# EasyEDA Pro project ProProject_ESP32-CAN (1)_2024-07-23.epro, schematic Schematic1

## Sheets
1 P1: Create Date: 2024-04-11; Page Name: P1; Project Name: ESP32-CAN; Schematic Name: Schematic1; Update Date: 2024-04-11; Company: EasyEDA.com; Drawn: EasyEDA; Page Size: A4; Part Number: JLCPCB-002; Reviewed: EasyEDA; Version: V0.1
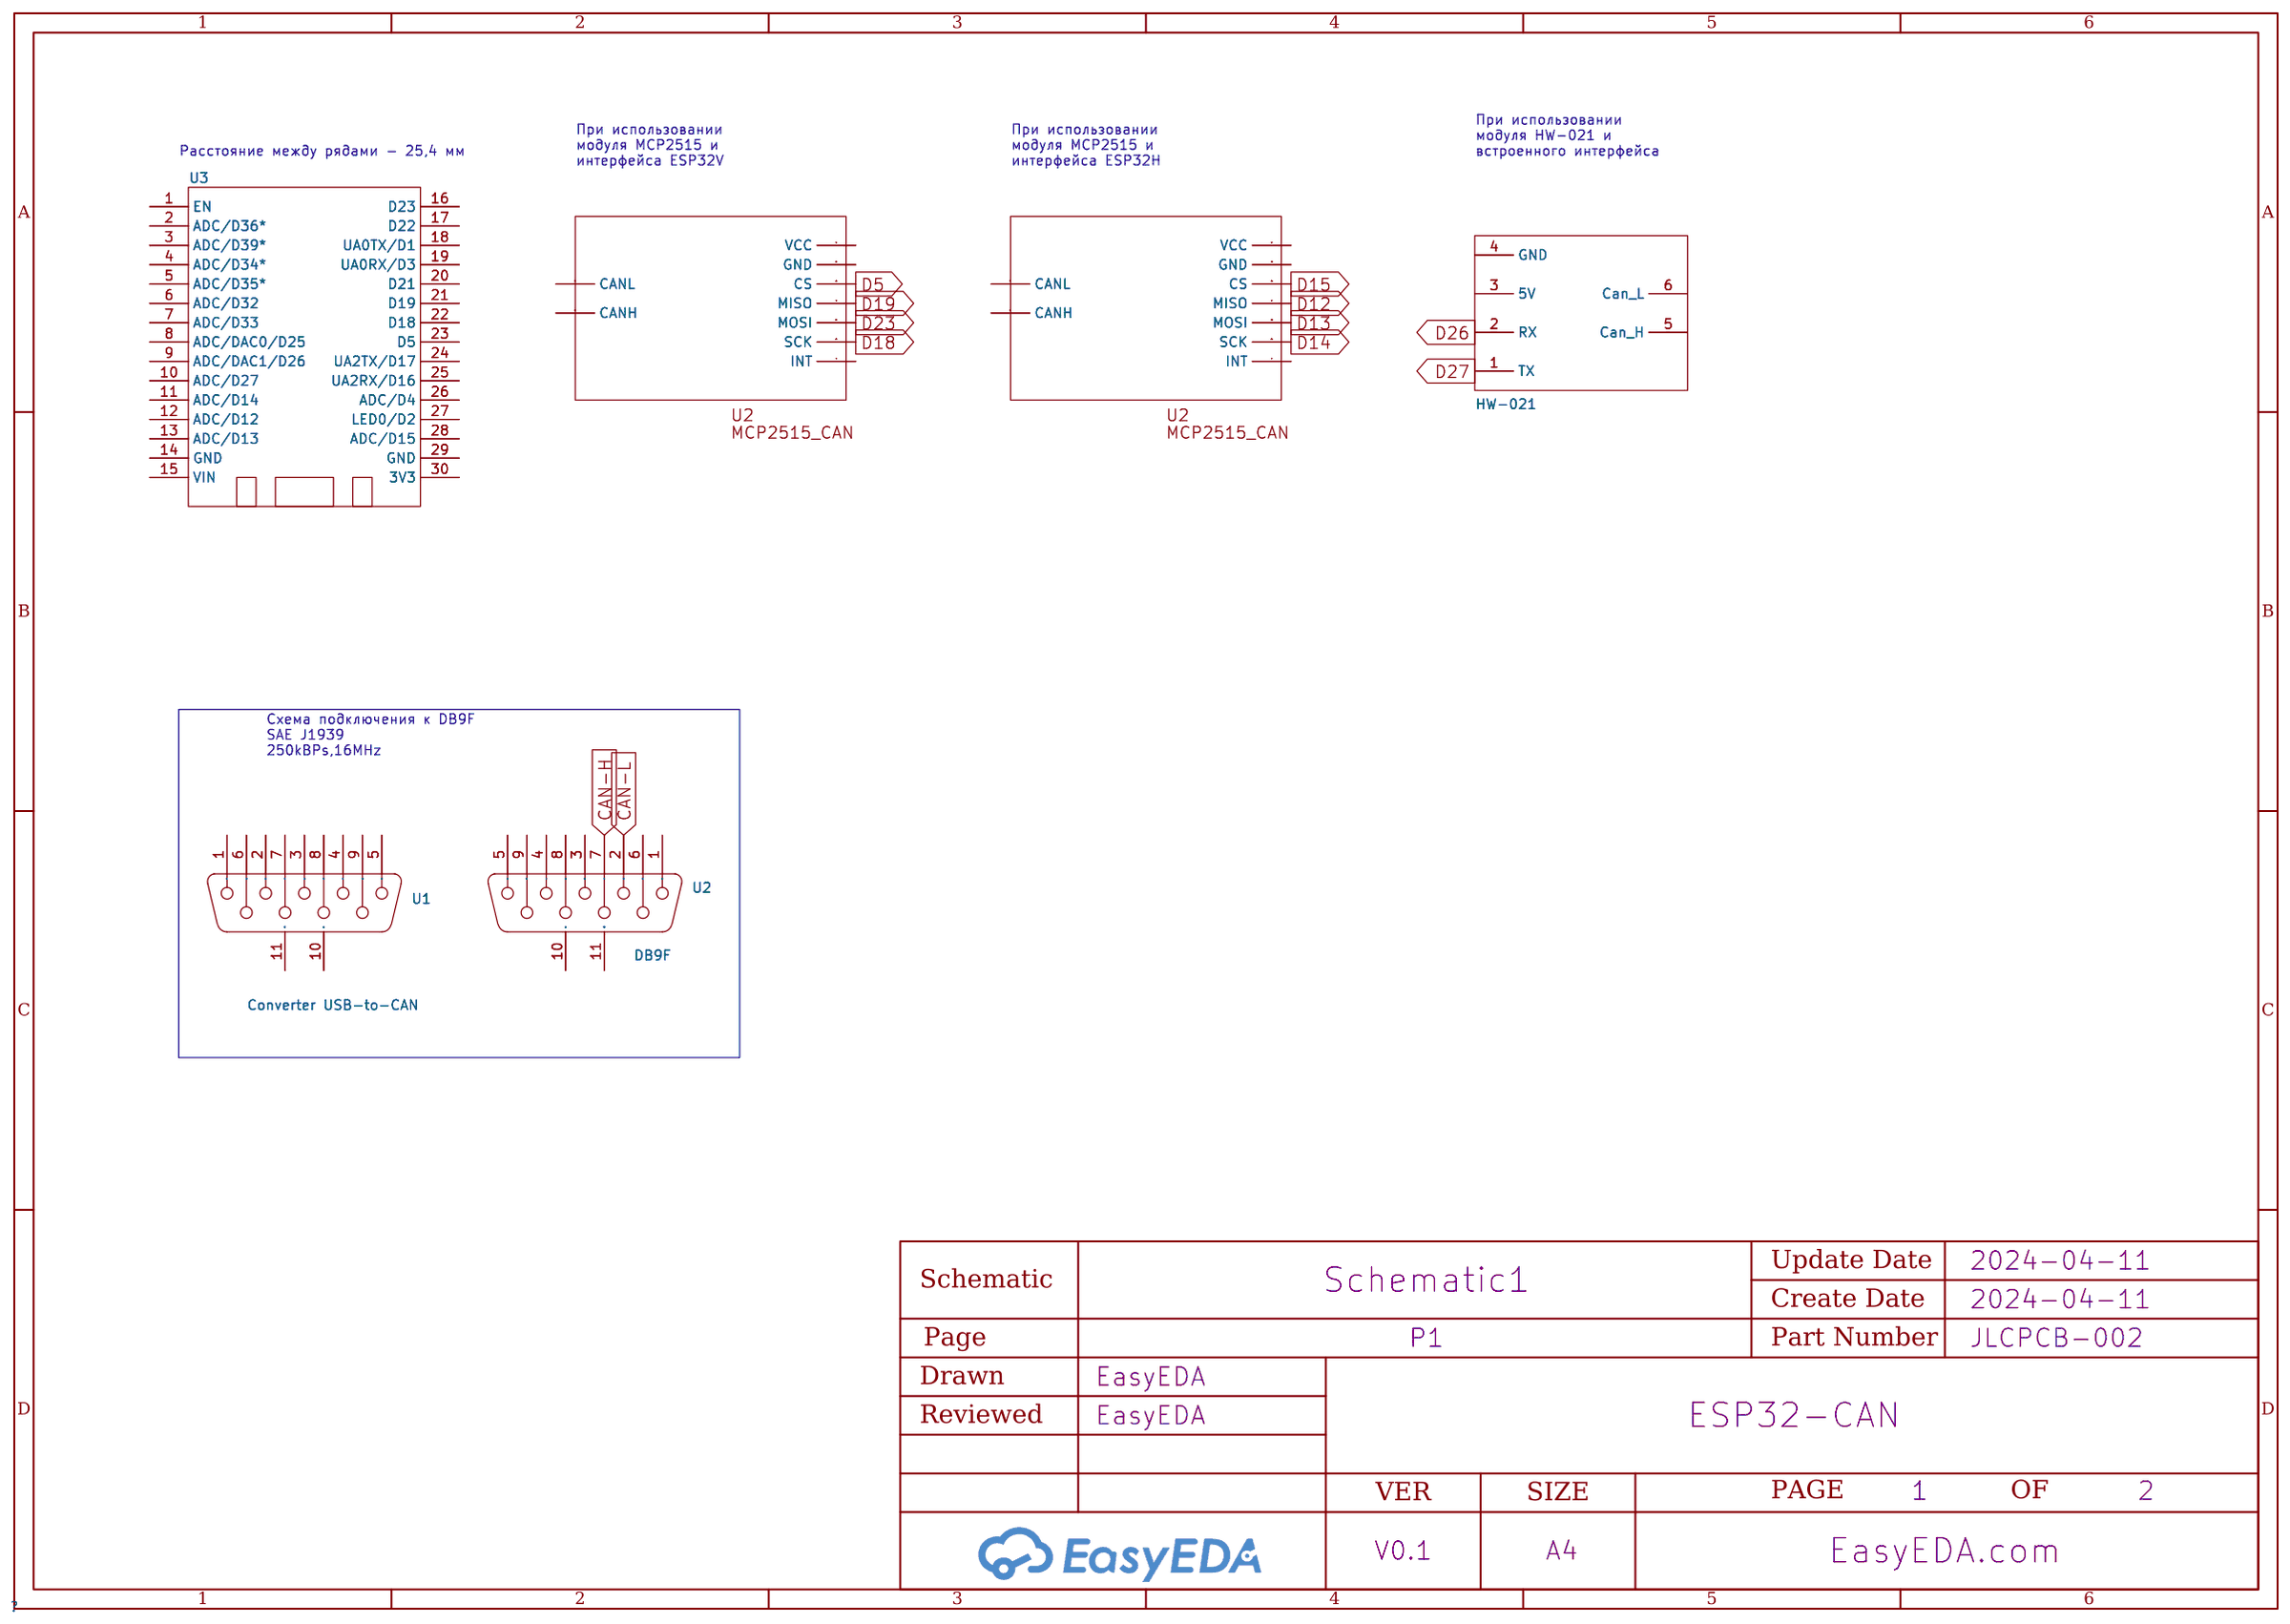
[diagram p5: P1]
2 P2: Create Date: 2024-04-18; Page Name: P2; Update Date: 2024-04-22
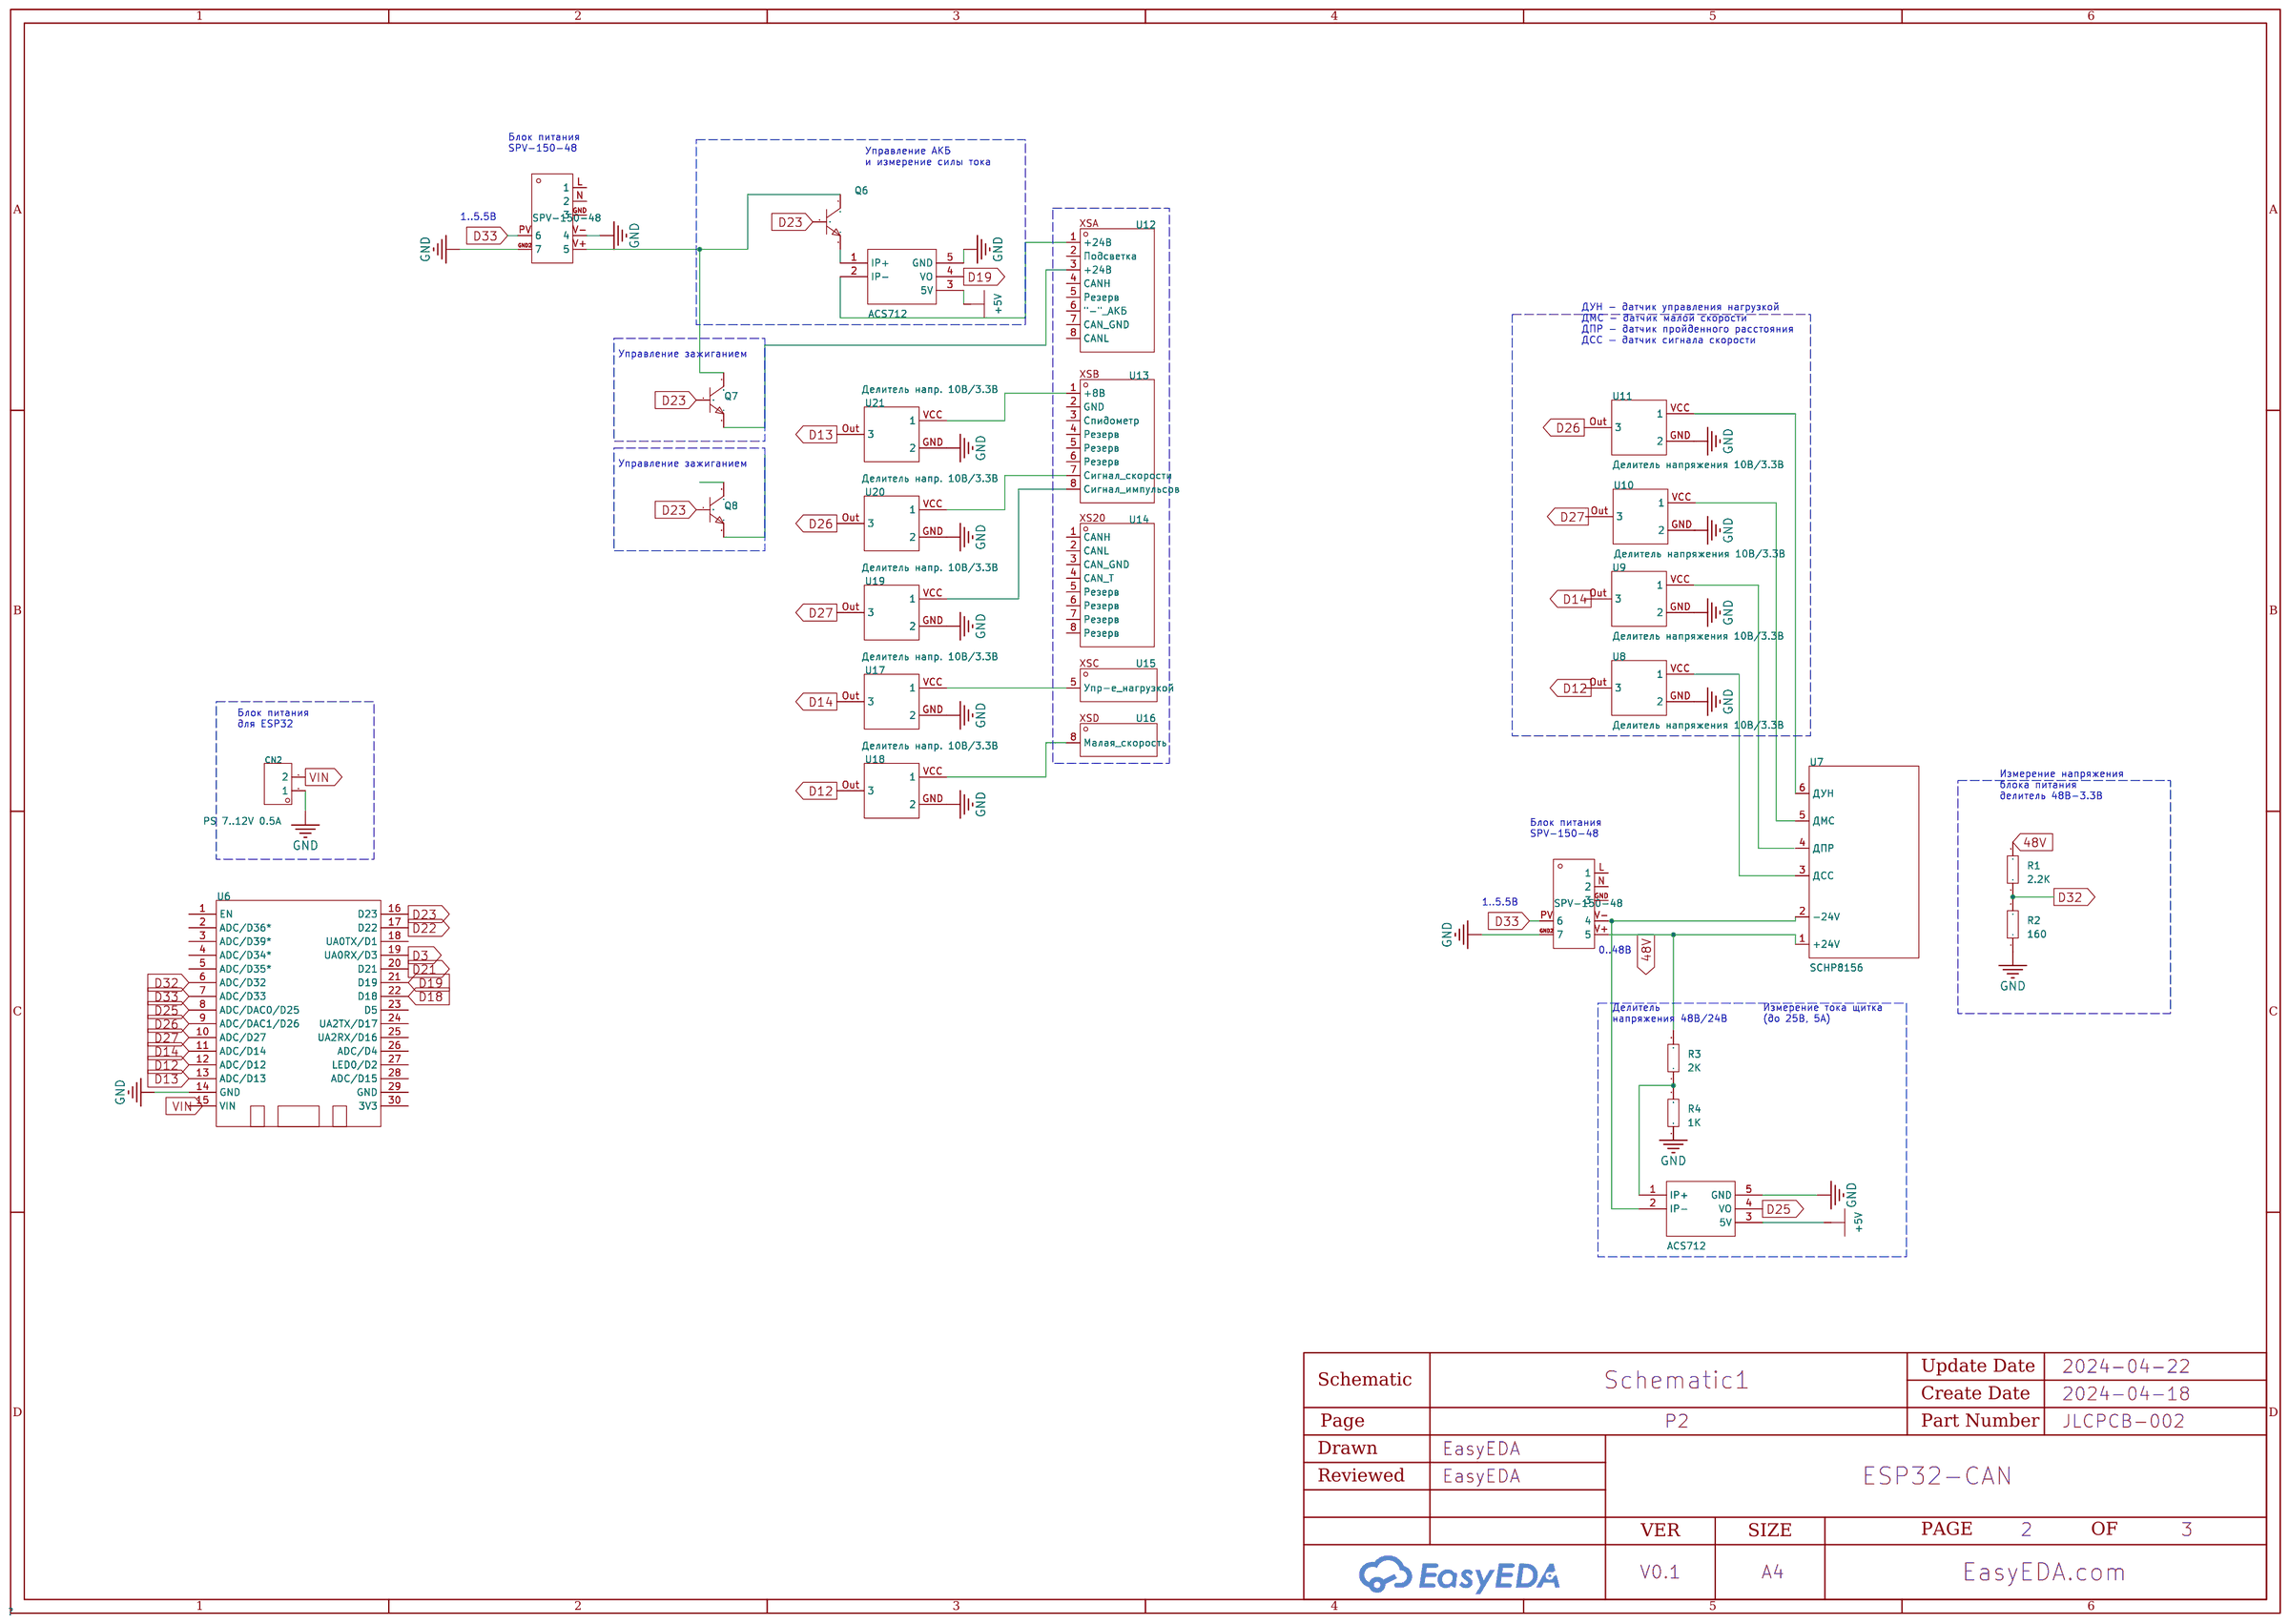
[diagram p6: P2]
3 P2a: Create Date: 2024-04-22; Page Name: P2a; Update Date: 2024-04-22; Page Size: A3; Part Number: JLCPCB-001
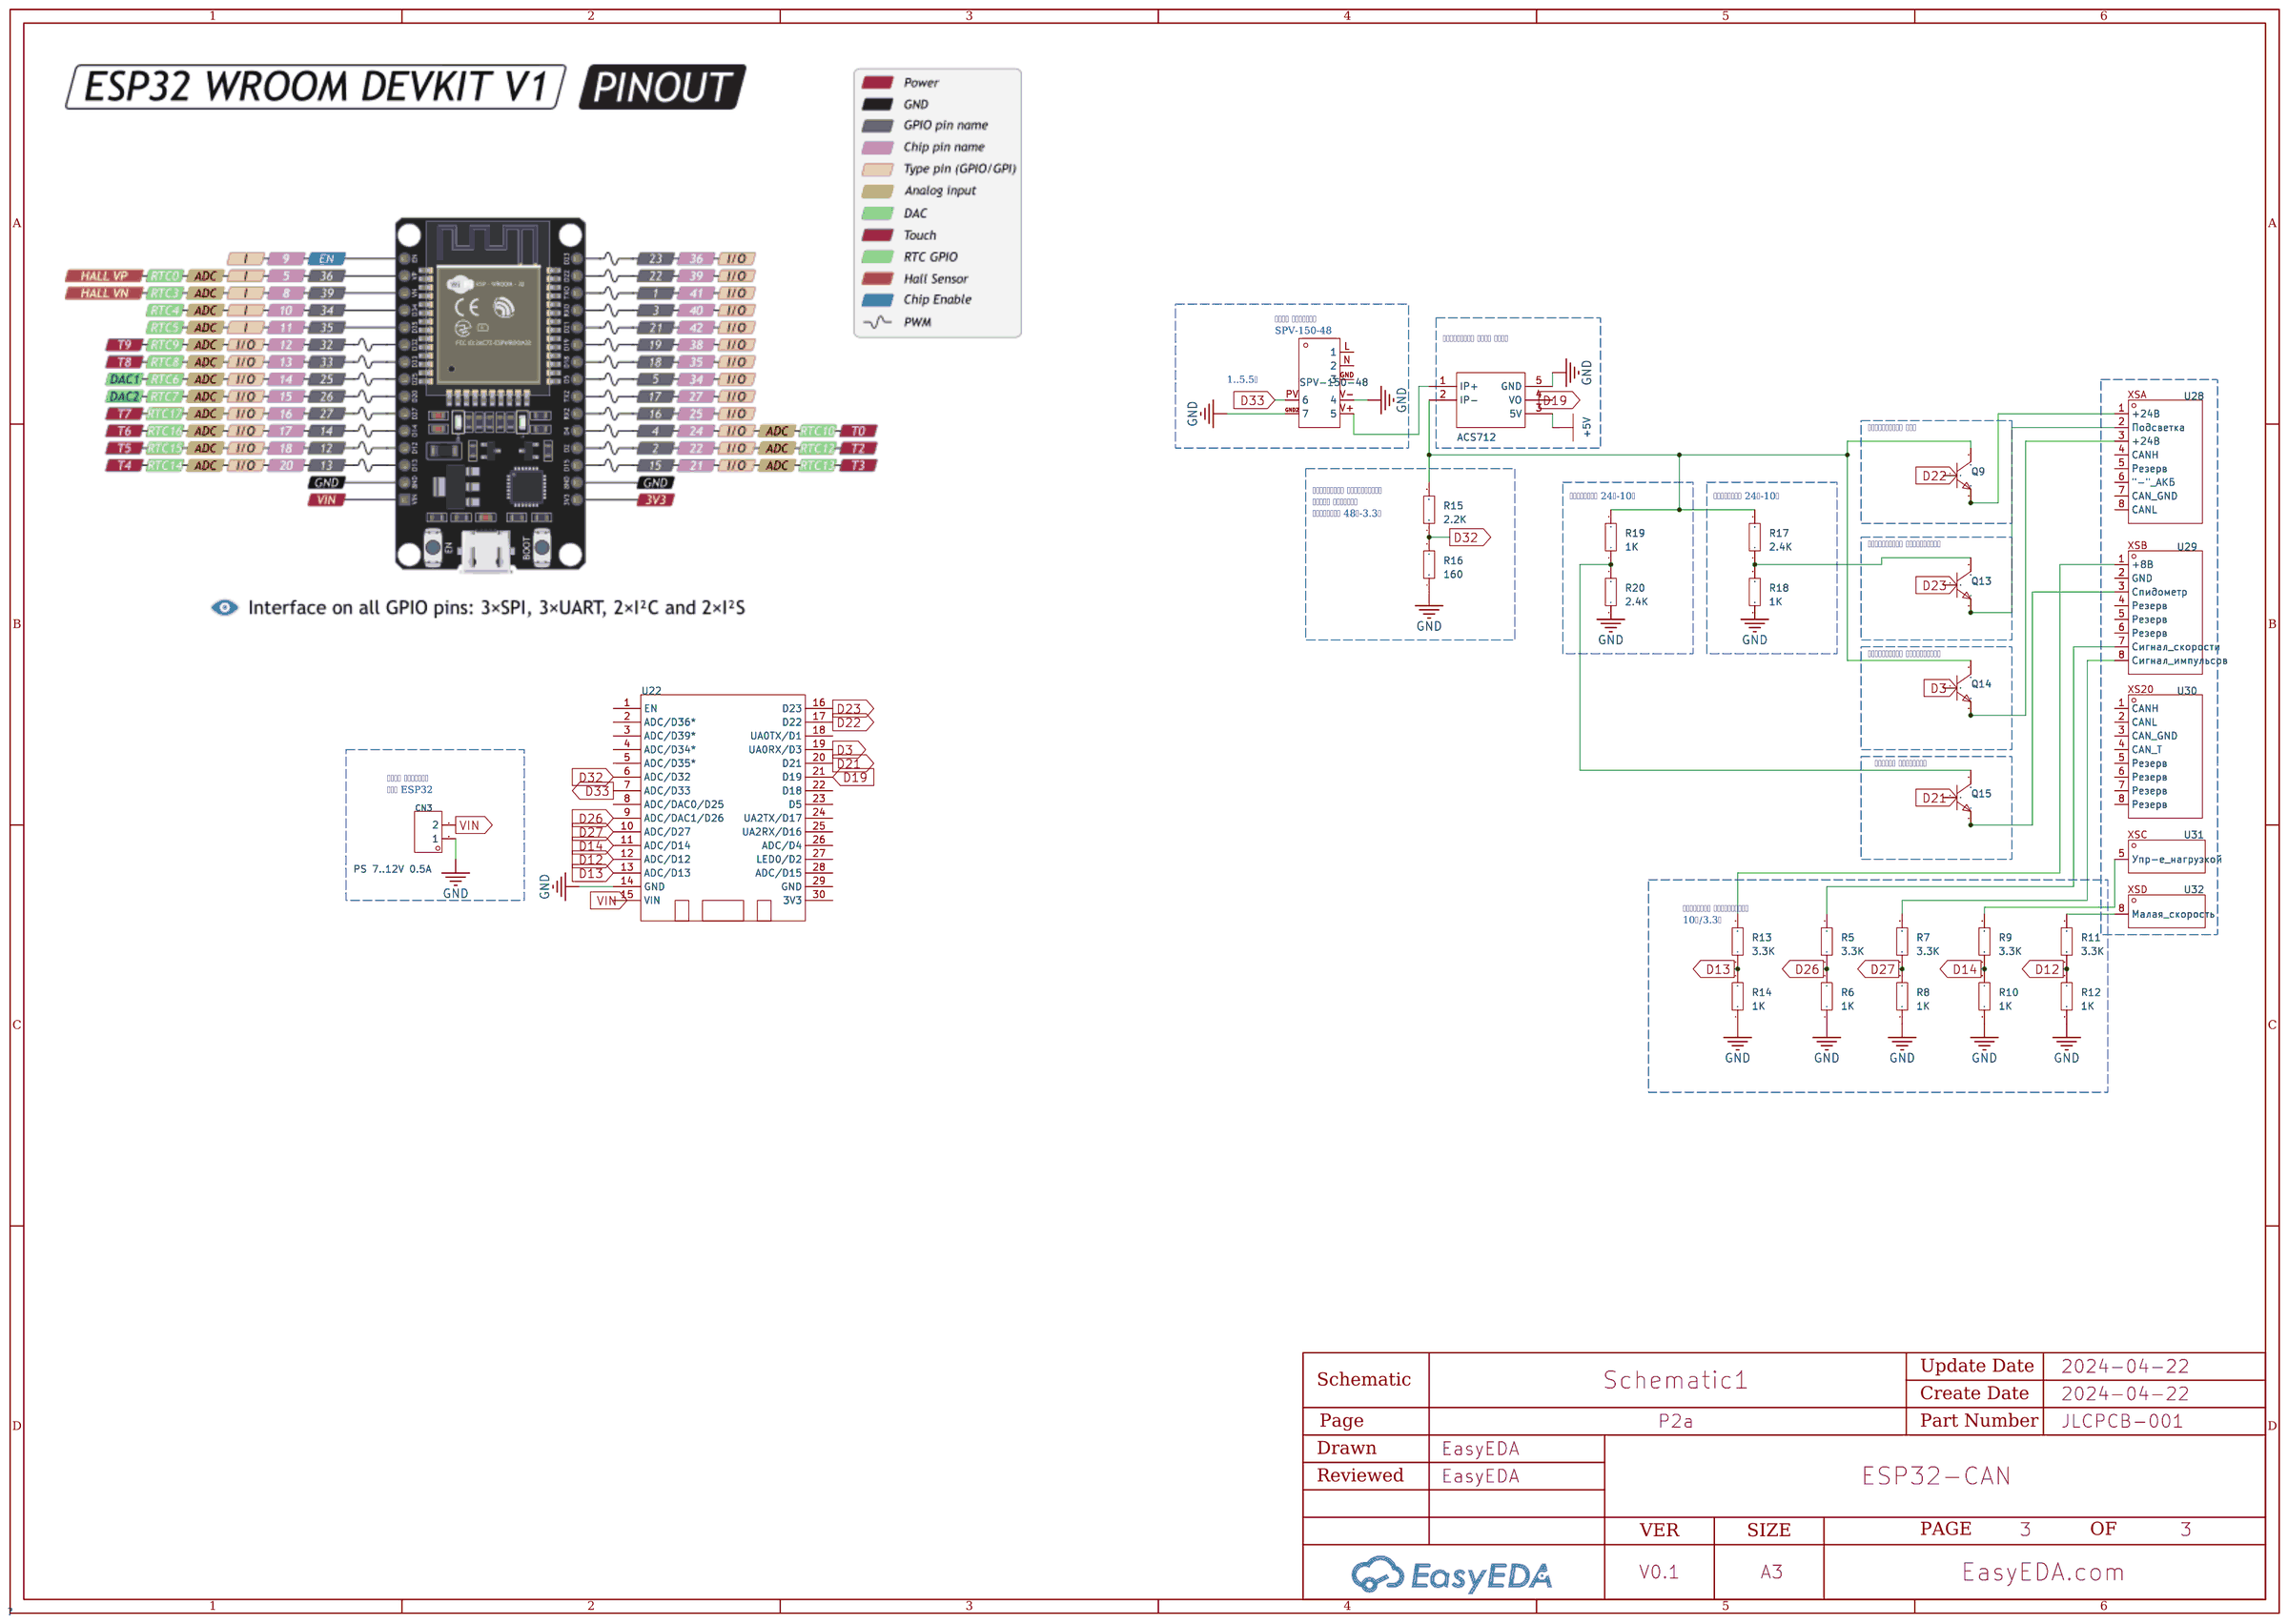
[diagram p7: P2a]
4 P3: Create Date: 2024-06-11; Page Name: P3; Project Name: ESP32-CAN (1); Update Date: 2024-07-06; Page Size: A3; Part Number: JLCPCB-001
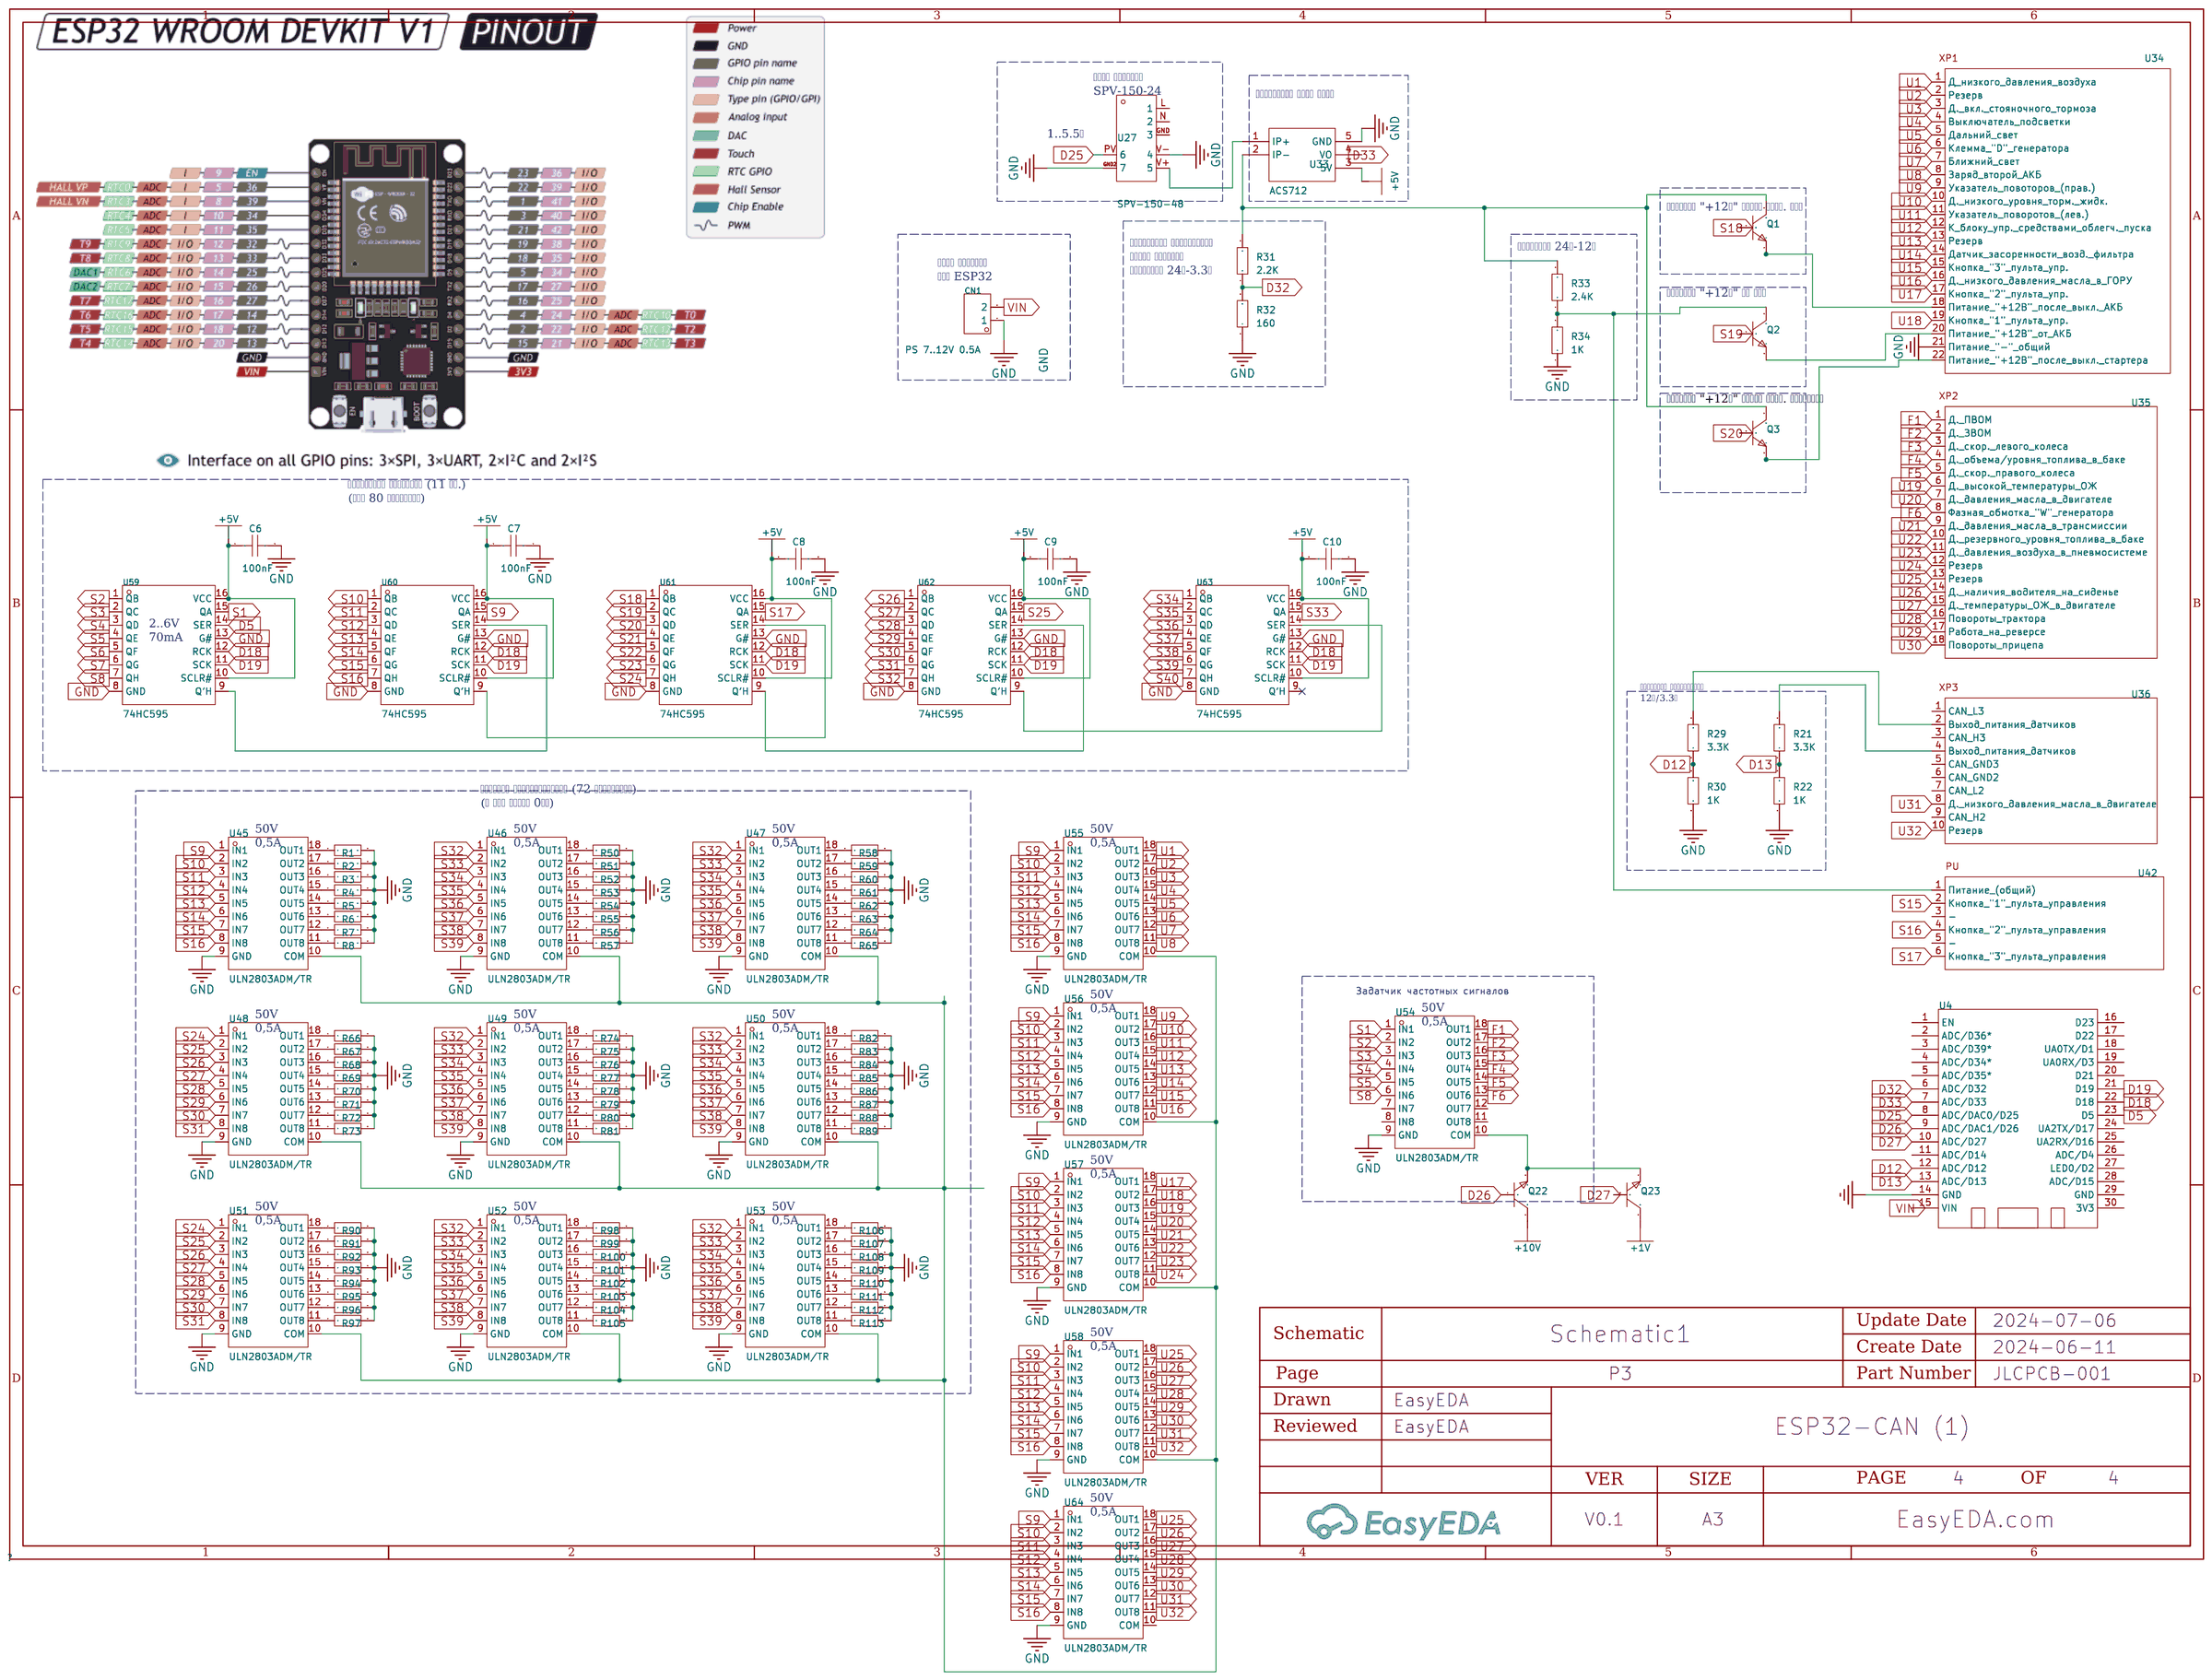
[diagram p8: P3]
5 P3_1: Create Date: 2024-07-23; Page Name: P3_1; Project Name: ESP32-CAN (1); Update Date: 2024-07-23; Page Size: A3; Part Number: JLCPCB-001
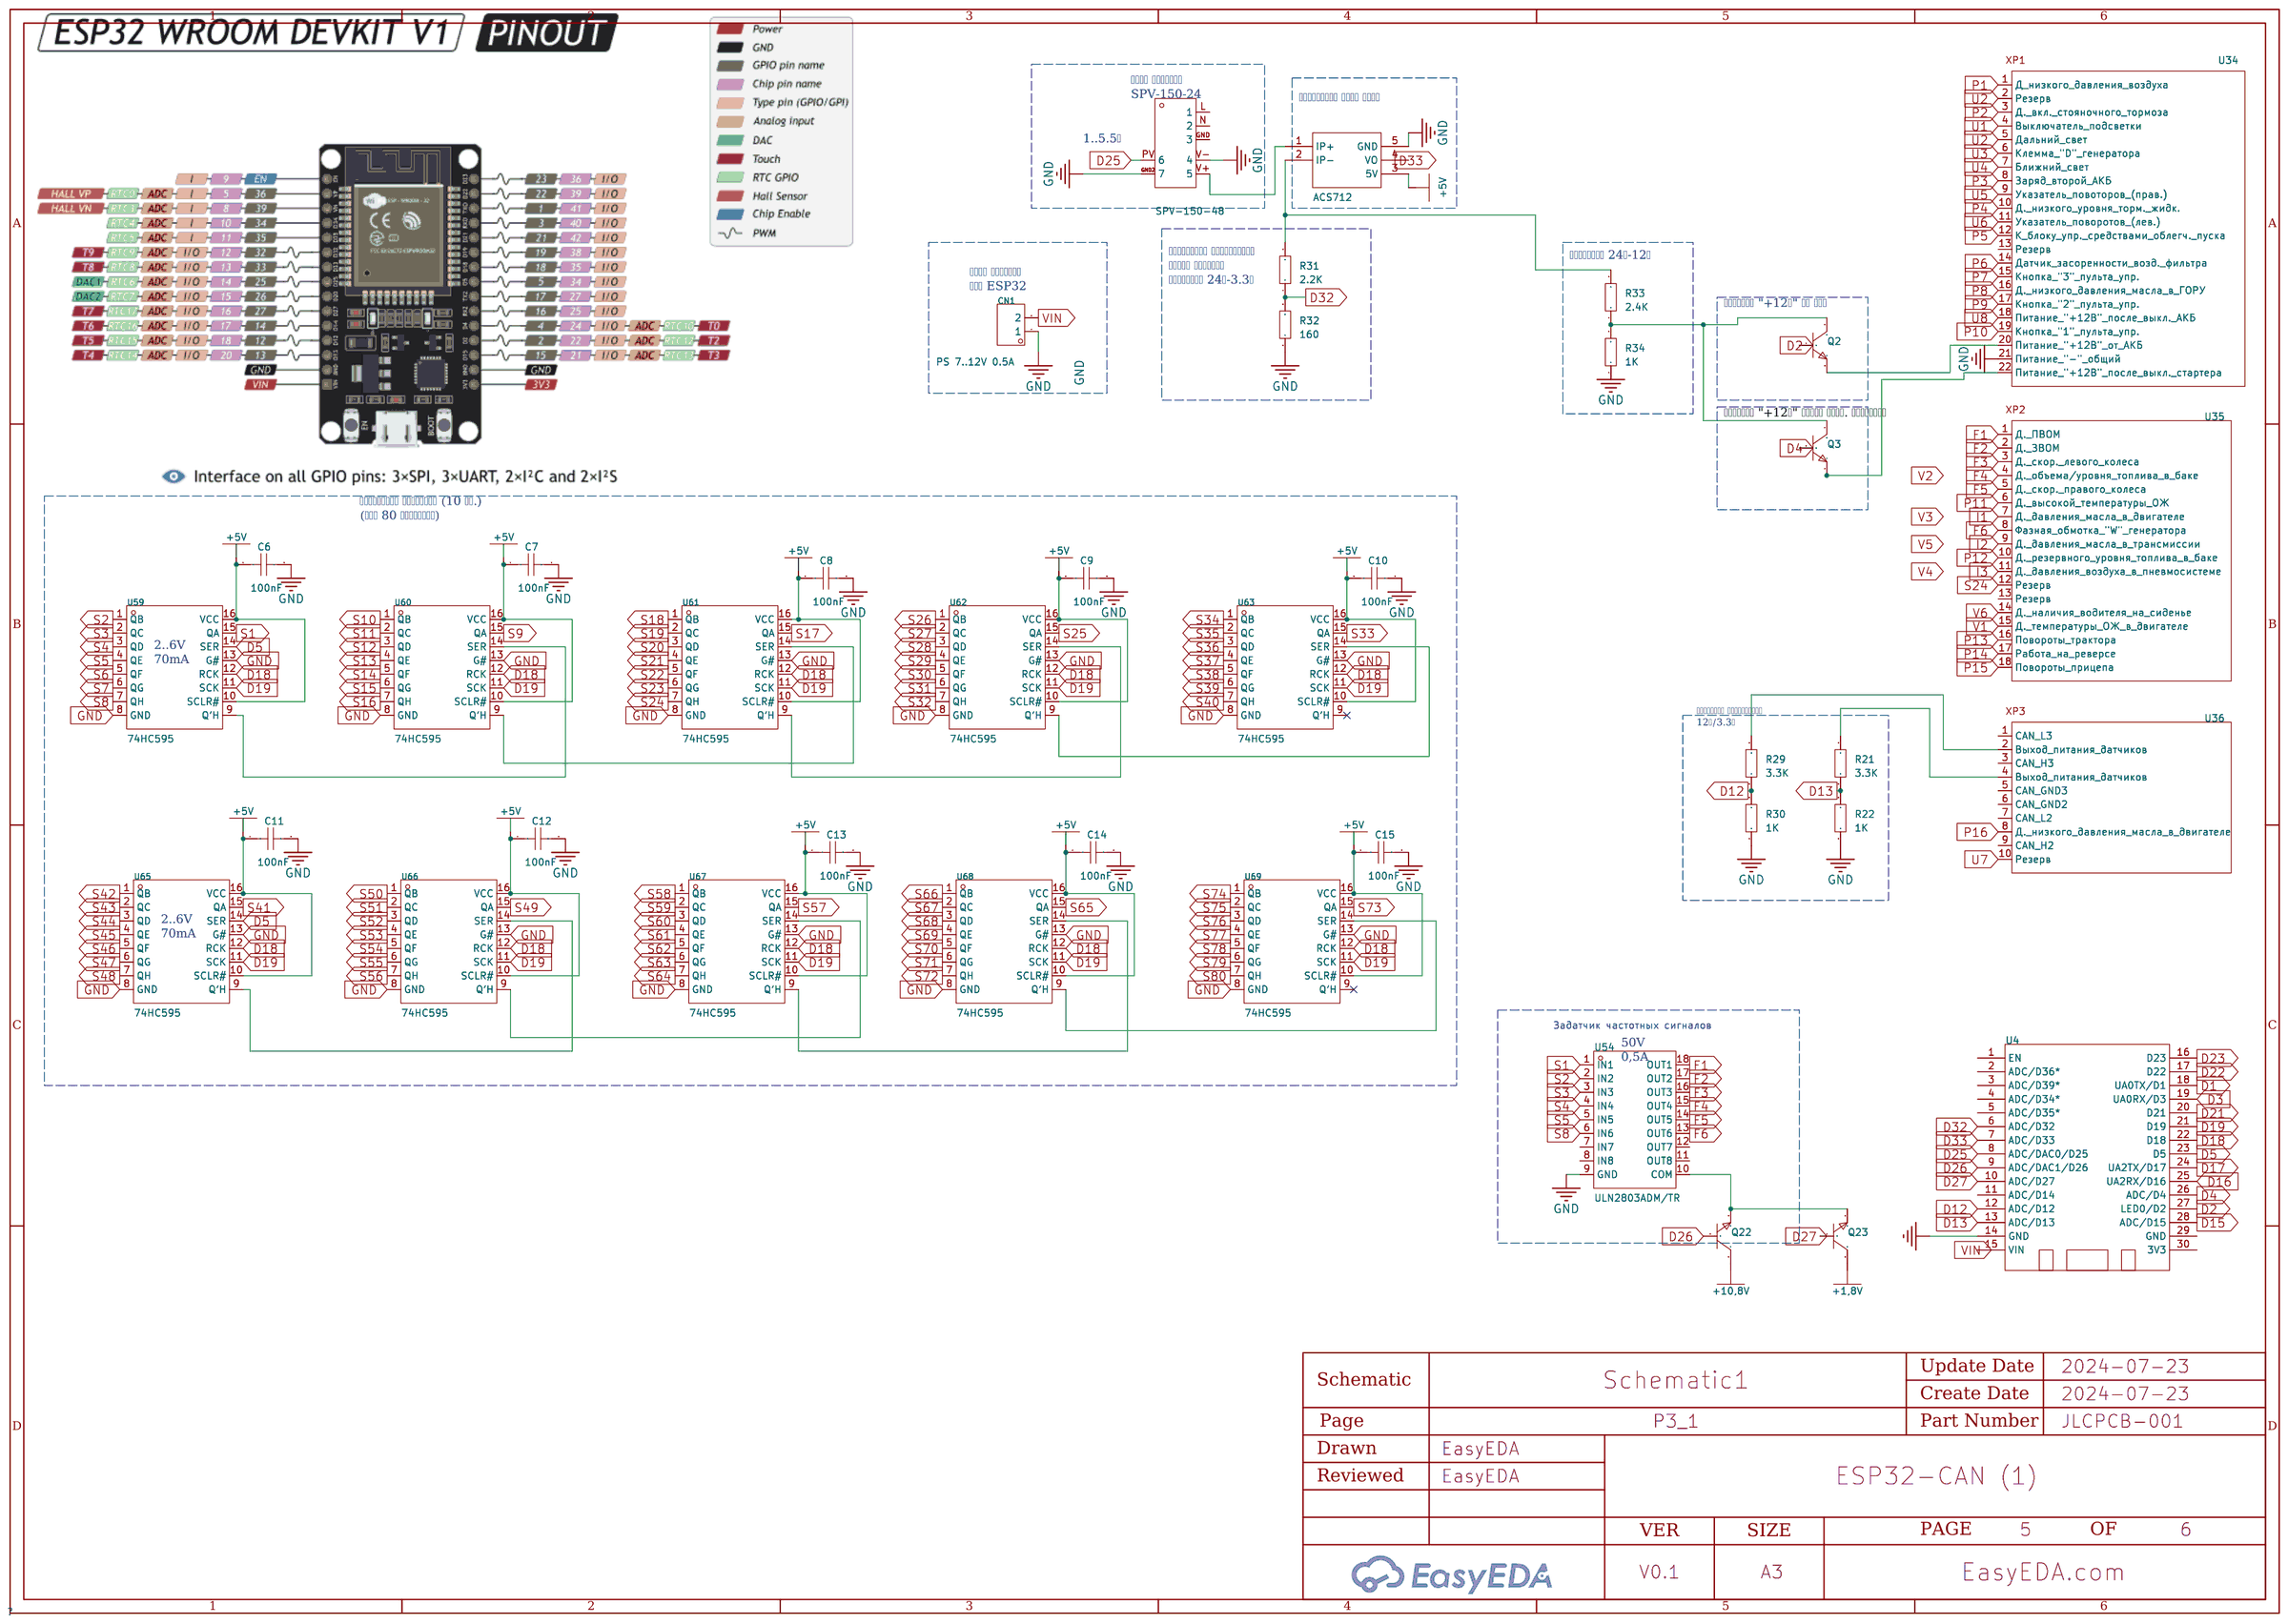
[diagram p9: P3_1]
6 P3_2: Create Date: 2024-07-23; Page Name: P3_2; Project Name: ESP32-CAN (1); Update Date: 2024-07-23; Page Size: A3; Part Number: JLCPCB-001
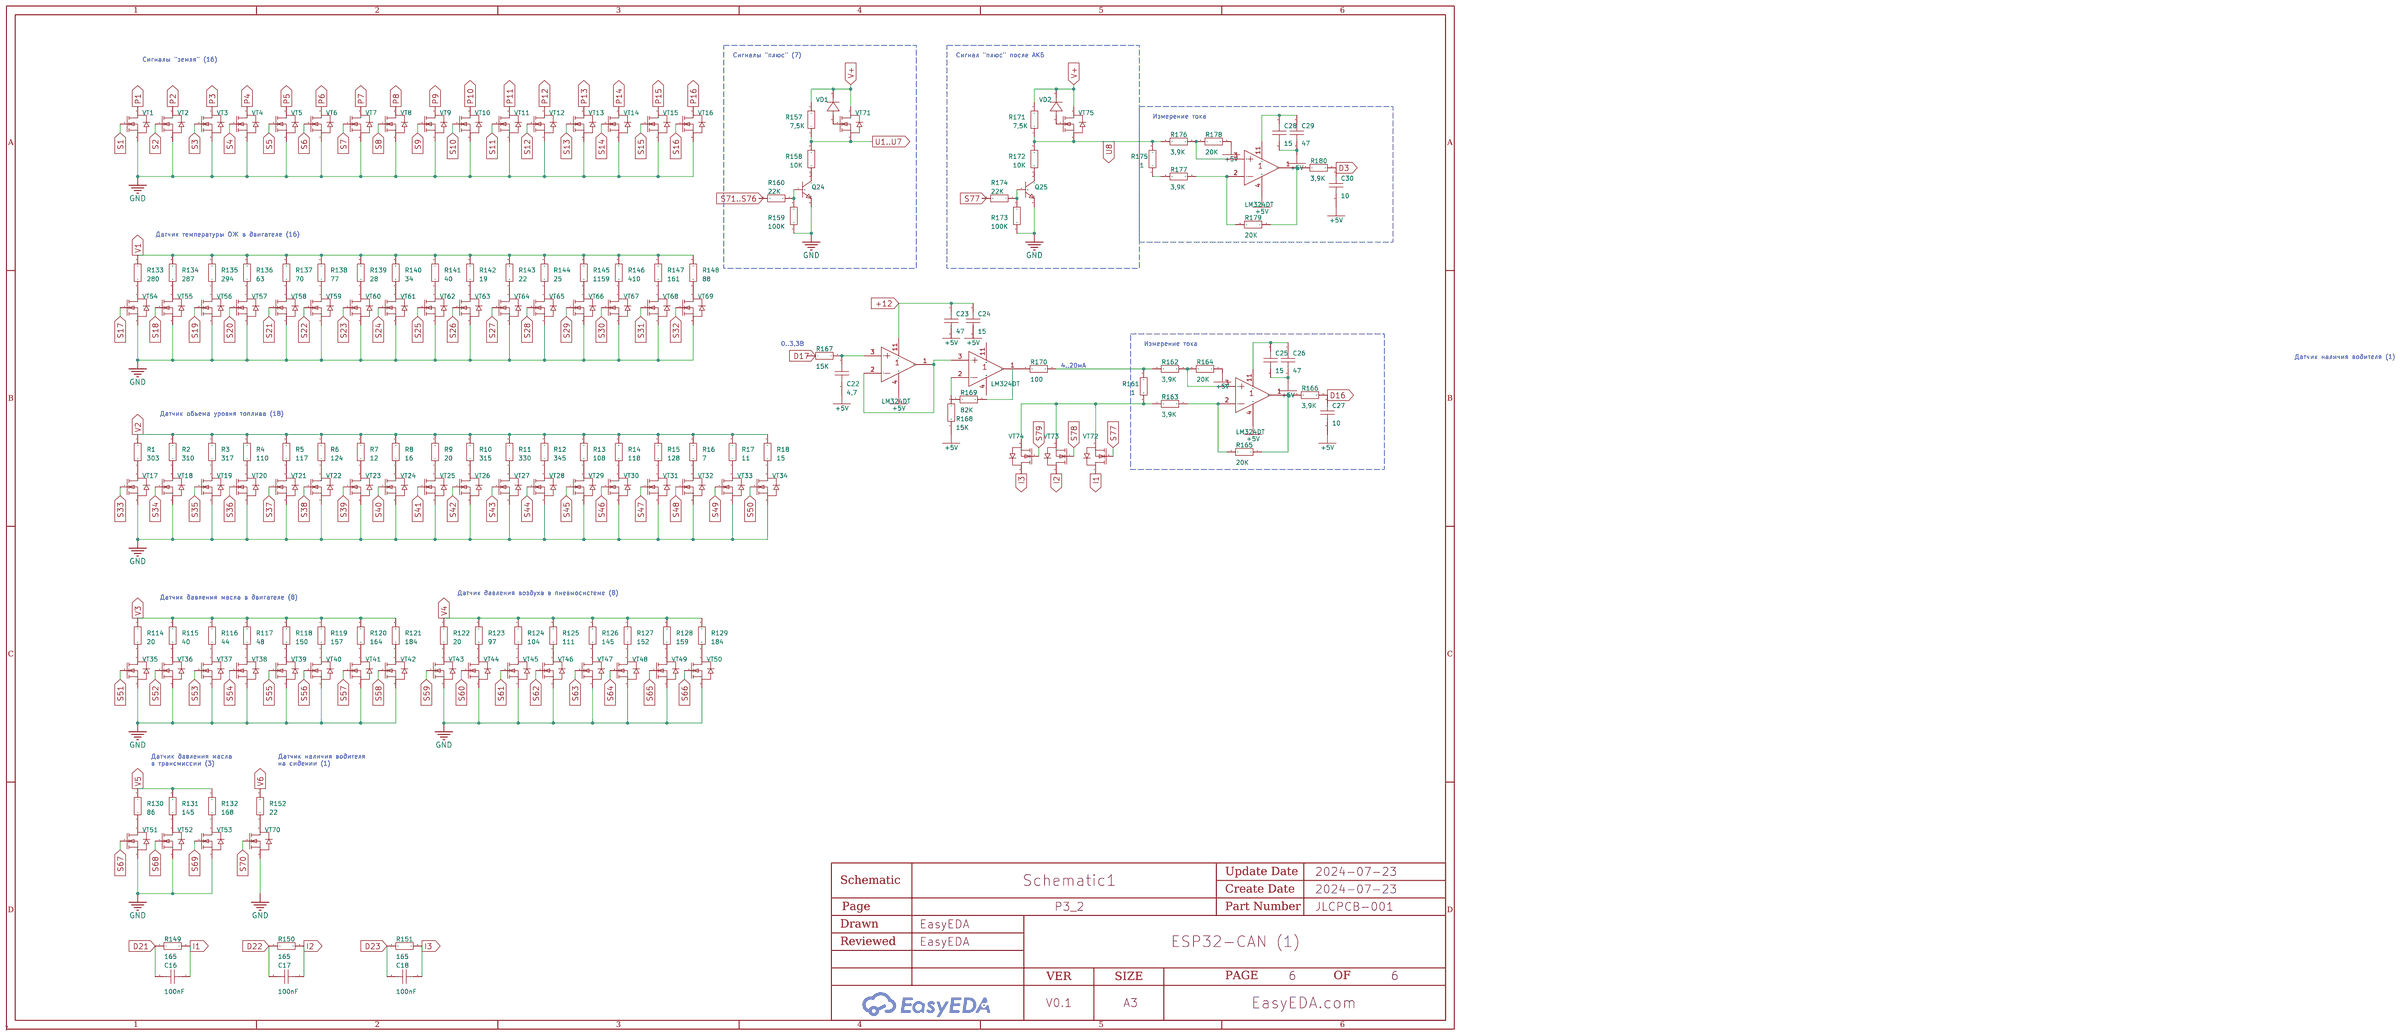
[diagram p10: P3_2]

## Parts
sheet P1
?#1  -
?#2  -
?#3  HW-021
U1  Converter USB-to-CAN  [DB9-TH_DB9F_C9900018961]
U2  DB9F  [DB9-TH_DB9F_C9900018961]
U3  -
sheet P2
?#4  SPV-150-48
?#5  ACS712
?#6  ACS712
?#7  SPV-150-48
CN2  PS 7..12V 0.5A  [CONN-TH_WJ2EDGVC-5.08-2P]
Q6  АКБ  [SOT-89-3_L4.5-W2.5-P1.50-LS4.2-BR]
Q7  АКБ  [SOT-89-3_L4.5-W2.5-P1.50-LS4.2-BR]
Q8  АКБ  [SOT-89-3_L4.5-W2.5-P1.50-LS4.2-BR]
R1  2.2K  [R0603]
R2  160  [R0603]
R3  2K  [R0603]
R4  1К  [R0603]
U6  -
U7  SCHP8156
U8  Делитель напряжения 10В/3.3В
U9  Делитель напряжения 10В/3.3В
U10  Делитель напряжения 10В/3.3В
U11  Делитель напряжения 10В/3.3В
U12  -
U13  -
U14  -
U15  -
U16  -
U17  Делитель напр. 10В/3.3В
U18  Делитель напр. 10В/3.3В
U19  Делитель напр. 10В/3.3В
U20  Делитель напр. 10В/3.3В
U21  Делитель напр. 10В/3.3В
sheet P2a
?#8  SPV-150-48
?#9  ACS712
CN3  PS 7..12V 0.5A  [CONN-TH_WJ2EDGVC-5.08-2P]
Q9  АКБ  [SOT-89-3_L4.5-W2.5-P1.50-LS4.2-BR]
Q13  АКБ  [SOT-89-3_L4.5-W2.5-P1.50-LS4.2-BR]
Q14  АКБ  [SOT-89-3_L4.5-W2.5-P1.50-LS4.2-BR]
Q15  АКБ  [SOT-89-3_L4.5-W2.5-P1.50-LS4.2-BR]
R5  3.3K  [R0603]
R6  1K  [R0603]
R7  3.3K  [R0603]
R8  1K  [R0603]
R9  3.3K  [R0603]
R10  1K  [R0603]
R11  3.3K  [R0603]
R12  1K  [R0603]
R13  3.3K  [R0603]
R14  1K  [R0603]
R15  2.2K  [R0603]
R16  160  [R0603]
R17  2.4K  [R0603]
R18  1K  [R0603]
R19  1K  [R0603]
R20  2.4K  [R0603]
U22  -
U28  -
U29  -
U30  -
U31  -
U32  -
sheet P3
C6  100nF  [C0603]
C7  100nF  [C0603]
C8  100nF  [C0603]
C9  100nF  [C0603]
C10  100nF  [C0603]
CN1  PS 7..12V 0.5A  [CONN-TH_WJ2EDGVC-5.08-2P]
Q1  АКБ  [SOT-89-3_L4.5-W2.5-P1.50-LS4.2-BR]
Q2  АКБ  [SOT-89-3_L4.5-W2.5-P1.50-LS4.2-BR]
Q3  АКБ  [SOT-89-3_L4.5-W2.5-P1.50-LS4.2-BR]
Q22  АКБ  [SOT-89-3_L4.5-W2.5-P1.50-LS4.2-BR]
Q23  АКБ  [SOT-89-3_L4.5-W2.5-P1.50-LS4.2-BR]
R1#2  10K  [R0603]
R2#2  10K  [R0603]
R3#2  10K  [R0603]
R4#2  10K  [R0603]
R5#2  10K  [R0603]
R6#2  10K  [R0603]
R7#2  10K  [R0603]
R8#2  10K  [R0603]
R21  3.3K  [R0603]
R22  1K  [R0603]
R29  3.3K  [R0603]
R30  1K  [R0603]
R31  2.2K  [R0603]
R32  160  [R0603]
R33  2.4K  [R0603]
R34  1K  [R0603]
R50  10K  [R0603]
R51  10K  [R0603]
R52  10K  [R0603]
R53  10K  [R0603]
R54  10K  [R0603]
R55  10K  [R0603]
R56  10K  [R0603]
R57  10K  [R0603]
R58  10K  [R0603]
R59  10K  [R0603]
R60  10K  [R0603]
R61  10K  [R0603]
R62  10K  [R0603]
R63  10K  [R0603]
R64  10K  [R0603]
R65  10K  [R0603]
R66  10K  [R0603]
R67  10K  [R0603]
R68  10K  [R0603]
R69  10K  [R0603]
R70  10K  [R0603]
R71  10K  [R0603]
R72  10K  [R0603]
R73  10K  [R0603]
R74  10K  [R0603]
R75  10K  [R0603]
R76  10K  [R0603]
R77  10K  [R0603]
R78  10K  [R0603]
R79  10K  [R0603]
R80  10K  [R0603]
R81  10K  [R0603]
R82  10K  [R0603]
R83  10K  [R0603]
R84  10K  [R0603]
R85  10K  [R0603]
R86  10K  [R0603]
R87  10K  [R0603]
R88  10K  [R0603]
R89  10K  [R0603]
R90  10K  [R0603]
R91  10K  [R0603]
R92  10K  [R0603]
R93  10K  [R0603]
R94  10K  [R0603]
R95  10K  [R0603]
R96  10K  [R0603]
R97  10K  [R0603]
R98  10K  [R0603]
R99  10K  [R0603]
R100  10K  [R0603]
R101  10K  [R0603]
R102  10K  [R0603]
R103  10K  [R0603]
R104  10K  [R0603]
R105  10K  [R0603]
R106  10K  [R0603]
R107  10K  [R0603]
R108  10K  [R0603]
R109  10K  [R0603]
R110  10K  [R0603]
R111  10K  [R0603]
R112  10K  [R0603]
R113  10K  [R0603]
U4  -
U27  SPV-150-48
U33  ACS712
U34  -
U35  -
U36  -
U42  -
U45  ULN2803ADM/TR  [SOP-18_L11.4-W7.6-P1.27-LS10.6-BL]
U46  ULN2803ADM/TR  [SOP-18_L11.4-W7.6-P1.27-LS10.6-BL]
U47  ULN2803ADM/TR  [SOP-18_L11.4-W7.6-P1.27-LS10.6-BL]
U48  ULN2803ADM/TR  [SOP-18_L11.4-W7.6-P1.27-LS10.6-BL]
U49  ULN2803ADM/TR  [SOP-18_L11.4-W7.6-P1.27-LS10.6-BL]
U50  ULN2803ADM/TR  [SOP-18_L11.4-W7.6-P1.27-LS10.6-BL]
U51  ULN2803ADM/TR  [SOP-18_L11.4-W7.6-P1.27-LS10.6-BL]
U52  ULN2803ADM/TR  [SOP-18_L11.4-W7.6-P1.27-LS10.6-BL]
U53  ULN2803ADM/TR  [SOP-18_L11.4-W7.6-P1.27-LS10.6-BL]
U54  ULN2803ADM/TR  [SOP-18_L11.4-W7.6-P1.27-LS10.6-BL]
U55  ULN2803ADM/TR  [SOP-18_L11.4-W7.6-P1.27-LS10.6-BL]
U56  ULN2803ADM/TR  [SOP-18_L11.4-W7.6-P1.27-LS10.6-BL]
U57  ULN2803ADM/TR  [SOP-18_L11.4-W7.6-P1.27-LS10.6-BL]
U58  ULN2803ADM/TR  [SOP-18_L11.4-W7.6-P1.27-LS10.6-BL]
U59  74HC595  [SOP-16_L9.9-W3.9-P1.27-LS6.0-BL]
U60  74HC595  [SOP-16_L9.9-W3.9-P1.27-LS6.0-BL]
U61  74HC595  [SOP-16_L9.9-W3.9-P1.27-LS6.0-BL]
U62  74HC595  [SOP-16_L9.9-W3.9-P1.27-LS6.0-BL]
U63  74HC595  [SOP-16_L9.9-W3.9-P1.27-LS6.0-BL]
U64  ULN2803ADM/TR  [SOP-18_L11.4-W7.6-P1.27-LS10.6-BL]
sheet P3_1
C6#2  100nF  [C0603]
C7#2  100nF  [C0603]
C8#2  100nF  [C0603]
C9#2  100nF  [C0603]
C10#2  100nF  [C0603]
C11  100nF  [C0603]
C12  100nF  [C0603]
C13  100nF  [C0603]
C14  100nF  [C0603]
C15  100nF  [C0603]
CN1#2  PS 7..12V 0.5A  [CONN-TH_WJ2EDGVC-5.08-2P]
Q2#2  АКБ  [SOT-89-3_L4.5-W2.5-P1.50-LS4.2-BR]
Q3#2  АКБ  [SOT-89-3_L4.5-W2.5-P1.50-LS4.2-BR]
Q22#2  АКБ  [SOT-89-3_L4.5-W2.5-P1.50-LS4.2-BR]
Q23#2  АКБ  [SOT-89-3_L4.5-W2.5-P1.50-LS4.2-BR]
R21#2  3.3K  [R0603]
R22#2  1K  [R0603]
R29#2  3.3K  [R0603]
R30#2  1K  [R0603]
R31#2  2.2K  [R0603]
R32#2  160  [R0603]
R33#2  2.4K  [R0603]
R34#2  1K  [R0603]
U4#2  -
U27#2  SPV-150-48
U33#2  ACS712
U34#2  -
U35#2  -
U36#2  -
U54#2  ULN2803ADM/TR  [SOP-18_L11.4-W7.6-P1.27-LS10.6-BL]
U59#2  74HC595  [SOP-16_L9.9-W3.9-P1.27-LS6.0-BL]
U60#2  74HC595  [SOP-16_L9.9-W3.9-P1.27-LS6.0-BL]
U61#2  74HC595  [SOP-16_L9.9-W3.9-P1.27-LS6.0-BL]
U62#2  74HC595  [SOP-16_L9.9-W3.9-P1.27-LS6.0-BL]
U63#2  74HC595  [SOP-16_L9.9-W3.9-P1.27-LS6.0-BL]
U65  74HC595  [SOP-16_L9.9-W3.9-P1.27-LS6.0-BL]
U66  74HC595  [SOP-16_L9.9-W3.9-P1.27-LS6.0-BL]
U67  74HC595  [SOP-16_L9.9-W3.9-P1.27-LS6.0-BL]
U68  74HC595  [SOP-16_L9.9-W3.9-P1.27-LS6.0-BL]
U69  74HC595  [SOP-16_L9.9-W3.9-P1.27-LS6.0-BL]
sheet P3_2
C16  100nF  [C0603]
C17  100nF  [C0603]
C18  100nF  [C0603]
C22  4,7  [C0603]
C23  47  [C0603]
C24  15  [C0603]
C25  15  [C0603]
C26  47  [C0603]
C27  10  [C0603]
C28  15  [C0603]
C29  47  [C0603]
C30  10  [C0603]
Q24  MMBT5551  [SOT-23-3_L2.9-W1.3-P1.90-LS2.4-BR]
Q25  MMBT5551  [SOT-23-3_L2.9-W1.3-P1.90-LS2.4-BR]
R1#3  303  [R0603]
R2#3  310  [R0603]
R3#3  317  [R0603]
R4#3  110  [R0603]
R5#3  117  [R0603]
R6#3  124  [R0603]
R7#3  12  [R0603]
R8#3  16  [R0603]
R9#2  20  [R0603]
R10#2  315  [R0603]
R11#2  330  [R0603]
R12#2  345  [R0603]
R13#2  108  [R0603]
R14#2  118  [R0603]
R15#2  128  [R0603]
R16#2  7  [R0603]
R17#2  11  [R0603]
R18#2  15  [R0603]
R114  20  [R0603]
R115  40  [R0603]
R116  44  [R0603]
R117  48  [R0603]
R118  150  [R0603]
R119  157  [R0603]
R120  164  [R0603]
R121  184  [R0603]
R122  20  [R0603]
R123  97  [R0603]
R124  104  [R0603]
R125  111  [R0603]
R126  145  [R0603]
R127  152  [R0603]
R128  159  [R0603]
R129  184  [R0603]
R130  86  [R0603]
R131  145  [R0603]
R132  168  [R0603]
R133  280  [R0603]
R134  287  [R0603]
R135  294  [R0603]
R136  63  [R0603]
R137  70  [R0603]
R138  77  [R0603]
R139  28  [R0603]
R140  34  [R0603]
R141  40  [R0603]
R142  19  [R0603]
R143  22  [R0603]
R144  25  [R0603]
R145  1159  [R0603]
R146  410  [R0603]
R147  161  [R0603]
R148  88  [R0603]
R149  165  [R0603]
R150  165  [R0603]
R151  165  [R0603]
R152  22  [R0603]
R157  7,5K  [R0603]
R158  10K  [R0603]
R159  100K  [R0603]
R160  22K  [R0603]
R161  1  [R0603]
R162  3,9K  [R0603]
R163  3,9K  [R0603]
R164  20K  [R0603]
R165  20K  [R0603]
R166  3,9K  [R0603]
R167  15K  [R0603]
R168  15K  [R0603]
R169  82K  [R0603]
R170  100  [R0603]
R171  7,5K  [R0603]
R172  10K  [R0603]
R173  100K  [R0603]
R174  22K  [R0603]
R175  1  [R0603]
R176  3,9K  [R0603]
R177  3,9K  [R0603]
R178  20K  [R0603]
R179  20K  [R0603]
R180  3,9K  [R0603]
U70  LM324DT  [SOIC-14_L8.7-W3.9-P1.27-LS6.0-BL]  (section 1)
U71  LM324DT  [SOIC-14_L8.7-W3.9-P1.27-LS6.0-BL]  (section 1)
U72  LM324DT  [SOIC-14_L8.7-W3.9-P1.27-LS6.0-BL]  (section 1)
U73  LM324DT  [SOIC-14_L8.7-W3.9-P1.27-LS6.0-BL]  (section 1)
VD1  -  [DO-41_BD2.4-L4.7-P8.70-D0.9-RD]
VD2  -  [DO-41_BD2.4-L4.7-P8.70-D0.9-RD]
VT1  HY5204  [TO-247-3_L15.8-W5.0-P5.44-L-1]
VT2  HY5204  [TO-247-3_L15.8-W5.0-P5.44-L-1]
VT3  HY5204  [TO-247-3_L15.8-W5.0-P5.44-L-1]
VT4  HY5204  [TO-247-3_L15.8-W5.0-P5.44-L-1]
VT5  HY5204  [TO-247-3_L15.8-W5.0-P5.44-L-1]
VT6  HY5204  [TO-247-3_L15.8-W5.0-P5.44-L-1]
VT7  HY5204  [TO-247-3_L15.8-W5.0-P5.44-L-1]
VT8  HY5204  [TO-247-3_L15.8-W5.0-P5.44-L-1]
VT9  HY5204  [TO-247-3_L15.8-W5.0-P5.44-L-1]
VT10  HY5204  [TO-247-3_L15.8-W5.0-P5.44-L-1]
VT11  HY5204  [TO-247-3_L15.8-W5.0-P5.44-L-1]
VT12  HY5204  [TO-247-3_L15.8-W5.0-P5.44-L-1]
VT13  HY5204  [TO-247-3_L15.8-W5.0-P5.44-L-1]
VT14  HY5204  [TO-247-3_L15.8-W5.0-P5.44-L-1]
VT15  HY5204  [TO-247-3_L15.8-W5.0-P5.44-L-1]
VT16  HY5204  [TO-247-3_L15.8-W5.0-P5.44-L-1]
VT17  HY5204  [TO-247-3_L15.8-W5.0-P5.44-L-1]
VT18  HY5204  [TO-247-3_L15.8-W5.0-P5.44-L-1]
VT19  HY5204  [TO-247-3_L15.8-W5.0-P5.44-L-1]
VT20  HY5204  [TO-247-3_L15.8-W5.0-P5.44-L-1]
VT21  HY5204  [TO-247-3_L15.8-W5.0-P5.44-L-1]
VT22  HY5204  [TO-247-3_L15.8-W5.0-P5.44-L-1]
VT23  HY5204  [TO-247-3_L15.8-W5.0-P5.44-L-1]
VT24  HY5204  [TO-247-3_L15.8-W5.0-P5.44-L-1]
VT25  HY5204  [TO-247-3_L15.8-W5.0-P5.44-L-1]
VT26  HY5204  [TO-247-3_L15.8-W5.0-P5.44-L-1]
VT27  HY5204  [TO-247-3_L15.8-W5.0-P5.44-L-1]
VT28  HY5204  [TO-247-3_L15.8-W5.0-P5.44-L-1]
VT29  HY5204  [TO-247-3_L15.8-W5.0-P5.44-L-1]
VT30  HY5204  [TO-247-3_L15.8-W5.0-P5.44-L-1]
VT31  HY5204  [TO-247-3_L15.8-W5.0-P5.44-L-1]
VT32  HY5204  [TO-247-3_L15.8-W5.0-P5.44-L-1]
VT33  HY5204  [TO-247-3_L15.8-W5.0-P5.44-L-1]
VT34  HY5204  [TO-247-3_L15.8-W5.0-P5.44-L-1]
VT35  HY5204  [TO-247-3_L15.8-W5.0-P5.44-L-1]
VT36  HY5204  [TO-247-3_L15.8-W5.0-P5.44-L-1]
VT37  HY5204  [TO-247-3_L15.8-W5.0-P5.44-L-1]
VT38  HY5204  [TO-247-3_L15.8-W5.0-P5.44-L-1]
VT39  HY5204  [TO-247-3_L15.8-W5.0-P5.44-L-1]
VT40  HY5204  [TO-247-3_L15.8-W5.0-P5.44-L-1]
VT41  HY5204  [TO-247-3_L15.8-W5.0-P5.44-L-1]
VT42  HY5204  [TO-247-3_L15.8-W5.0-P5.44-L-1]
VT43  HY5204  [TO-247-3_L15.8-W5.0-P5.44-L-1]
VT44  HY5204  [TO-247-3_L15.8-W5.0-P5.44-L-1]
VT45  HY5204  [TO-247-3_L15.8-W5.0-P5.44-L-1]
VT46  HY5204  [TO-247-3_L15.8-W5.0-P5.44-L-1]
VT47  HY5204  [TO-247-3_L15.8-W5.0-P5.44-L-1]
VT48  HY5204  [TO-247-3_L15.8-W5.0-P5.44-L-1]
VT49  HY5204  [TO-247-3_L15.8-W5.0-P5.44-L-1]
VT50  HY5204  [TO-247-3_L15.8-W5.0-P5.44-L-1]
VT51  HY5204  [TO-247-3_L15.8-W5.0-P5.44-L-1]
VT52  HY5204  [TO-247-3_L15.8-W5.0-P5.44-L-1]
VT53  HY5204  [TO-247-3_L15.8-W5.0-P5.44-L-1]
VT54  HY5204  [TO-247-3_L15.8-W5.0-P5.44-L-1]
VT55  HY5204  [TO-247-3_L15.8-W5.0-P5.44-L-1]
VT56  HY5204  [TO-247-3_L15.8-W5.0-P5.44-L-1]
VT57  HY5204  [TO-247-3_L15.8-W5.0-P5.44-L-1]
VT58  HY5204  [TO-247-3_L15.8-W5.0-P5.44-L-1]
VT59  HY5204  [TO-247-3_L15.8-W5.0-P5.44-L-1]
VT60  HY5204  [TO-247-3_L15.8-W5.0-P5.44-L-1]
VT61  HY5204  [TO-247-3_L15.8-W5.0-P5.44-L-1]
VT62  HY5204  [TO-247-3_L15.8-W5.0-P5.44-L-1]
VT63  HY5204  [TO-247-3_L15.8-W5.0-P5.44-L-1]
VT64  HY5204  [TO-247-3_L15.8-W5.0-P5.44-L-1]
VT65  HY5204  [TO-247-3_L15.8-W5.0-P5.44-L-1]
VT66  HY5204  [TO-247-3_L15.8-W5.0-P5.44-L-1]
VT67  HY5204  [TO-247-3_L15.8-W5.0-P5.44-L-1]
VT68  HY5204  [TO-247-3_L15.8-W5.0-P5.44-L-1]
VT69  HY5204  [TO-247-3_L15.8-W5.0-P5.44-L-1]
VT70  HY5204  [TO-247-3_L15.8-W5.0-P5.44-L-1]
VT71  HY5204  [TO-247-3_L15.8-W5.0-P5.44-L-1]
VT72  HY5204  [TO-247-3_L15.8-W5.0-P5.44-L-1]
VT73  HY5204  [TO-247-3_L15.8-W5.0-P5.44-L-1]
VT74  HY5204  [TO-247-3_L15.8-W5.0-P5.44-L-1]
VT75  HY5204  [TO-247-3_L15.8-W5.0-P5.44-L-1]

## Library data of the parts
?#1 ?#2 = MODULE MCP2515 CANBUS
?#3 = Can_Uart 5v
U1 U2 = DB9F: Supplier Part: C9900018961; Supplier Footprint: DB9; Supplier: LCSC
U3 U4 U4#2 U6 U22 = ESP32 devkit v1
?#4 ?#7 ?#8 U27 U27#2 = SPV-300-48
?#5 ?#6 ?#9 U33 U33#2 = Low Current Sensor - ACS712
CN1 CN1#2 CN2 CN3 = WJ2EDGVC-5.08-2P: Connector Type:板端/Receptacle-Close Structure:1x2P Pitch:5.08mm Color:Green Mounting Style:直针 Number of Pins:2P Number of Rows:1 Number of PINs Per Row:2; LCSC Part Name: 5.08mm 1x2P 排数:1 每排P数:2; Supplier Part: C8445; Manufacturer: KANGNEX(康奈克斯电气); Supplier Footprint: 插件,P=5.08mm; JLCPCB Part Class: Extended Part; Datasheet: https://atta.szlcsc.com/upload/public/pdf/source/20191225/C8445_EB1D2D396D429FBA4C627FE17CC77AF0.pdf; Supplier: LCSC; Connector Type: 板端/Receptacle-Close; Structure: 1x2P; Pitch: 5.08mm; Color: Green; Mounting Style: 直针; Number of Pins: 2P; Number of Rows: 1; Number of PINs Per Row: 2
Q1 Q2 Q2#2 Q3 Q3#2 Q6-Q9 Q13-Q15 Q22 Q22#2 Q23 Q23#2 = D882 Y档160~320: Transistor Type: Collector Current (Ic): Collector-Emitter Breakdown Voltage (Vceo): Power Dissipation (Pd):; LCSC Part Name: D882 Y档160~320(RANGE:160-320) Y档 160~320; Supplier Part: C9634; Manufacturer: CJ(江苏长电/长晶); Supplier Footprint: SOT-89-3; JLCPCB Part Class: Basic Part; Datasheet: https://atta.szlcsc.com/upload/public/pdf/source/20121027/1457706543612.pdf; Supplier: LCSC
R1 R1#2 R1#3 R2 R2#2 R2#3 R3 R3#2 R3#3 R4 R4#2 R4#3 R5 R5#2 R5#3 R6 R6#2 R6#3 R7 R7#2 R7#3 R8 R8#2 R8#3 R9 R9#2 R10 R10#2 R11 R11#2 R12 R12#2 R13 R13#2 R14 R14#2 R15 R15#2 R16 R16#2 R17 R17#2 R18 R18#2 R19-R21 R21#2 R22 R22#2 R29 R29#2 R30 R30#2 R31 R31#2 R32 R32#2 R33 R33#2 R34 R34#2 R50-R152 R157-R180 = Res_0603: Supplier Footprint: 0603
U7 = SHP8156
U8-U11 U17-U21 = Voltage divider
U12 U28 = Connector XSA
U13 U29 = Connector XSB
U14 U30 = Connector XS20
U15 U31 = Connector XSС
U16 U32 = Connector XSD
C6 C6#2 C7 C7#2 C8 C8#2 C9 C9#2 C10 C10#2 C11-C18 C22-C30 = CAP_0603: Supplier Footprint: 0603
U34 U34#2 = Connector XP1
U35 U35#2 = Connector XP2
U36 U36#2 = Connector XP3
U42 = PU
U45-U54 U54#2 U55-U58 U64 = ULN2803ADM/TR: number of channels:八路; Supplier Part: C2683131; Manufacturer: HGSEMI(华冠); Supplier Footprint: SOP-18-300mil; JLCPCB Part Class: Extended Part; Datasheet: https://atta.szlcsc.com/upload/public/pdf/source/20231009/94AF2541D05EF3AF782C5D5776E3D68F.pdf; Supplier: LCSC; number of channels: 八路
U59 U59#2 U60 U60#2 U61 U61#2 U62 U62#2 U63 U63#2 U65-U69 = 74HC595: Function:串行至串行或并行 Supply Voltage:2V~6V Supply Voltage:2V~6V Number of Elements:1 Number of Bits per Element:8 Output Type:Tri-State Series: Operating Temperature:-40℃~+85℃ Operating Temperature:-40℃~+85℃; Supplier Part: C18164493; Manufacturer: GR(国睿); Supplier Footprint: SOP-16; Datasheet: https://atta.szlcsc.com/upload/public/pdf/source/20230915/F264A7C02E418D1689E15579DAA93EB8.pdf; Supplier: LCSC; Function: 串行至串行或并行; Supply Voltage: 2V~6V; Number of Elements: 1; Number of Bits per Element: 8; Output Type: Tri-State; Operating Temperature: -40℃~+85℃
Q24 Q25 = MMBT5551_C2145: Transistor Type: Collector Current (Ic): Collector-Emitter Breakdown Voltage (Vceo): Power Dissipation (Pd): DC Current Gain (hFE@Ic,Vce):200@10mA,5V DC Current Gain (hFE@Ic,Vce):200@10mA,5V Transition Frequency (fT):100MHz Collector Cut-Off Current (Icbo; LCSC Part Name: MMBT5551(RANGE:200-300) hfe=200~300; Supplier Part: C2145; Manufacturer: CJ(江苏长电/长晶); Supplier Footprint: SOT-23; JLCPCB Part Class: Basic Part; Datasheet: https://atta.szlcsc.com/upload/public/pdf/source/20140321/1457707027001.pdf; Supplier: LCSC; DC Current Gain (hFE@Ic,Vce): 200@10mA,5V; Transition Frequency (fT): 100MHz; Collector Cut-Off Current (Icbo): 50nA; Collector-Emitter Saturation Voltage (VCE(sat)@Ic,Ib): 200mV@50mA,5mA
U70-U73 = LM324DT: Number of Circuits:Quad Gain Bandwidth Product(GBP):1.3MHz Current - Input Bias(Ib):20nA Slew Rate(SR):0.4V/us Output Current:40mA -3db Bandwidth:- Supply Current:1.5mA Operating Temperature:0℃~+70℃ Operating Temperature:0℃~+70℃; Supplier Part: C71035; Manufacturer: ST(意法半导体); Supplier Footprint: SOIC-14; JLCPCB Part Class: Basic Part; Datasheet: https://atta.szlcsc.com/upload/public/pdf/source/20160408/1460100649718.pdf; Supplier: LCSC; Number of Circuits: Quad; Gain Bandwidth Product(GBP): 1.3MHz; Current - Input Bias(Ib): 20nA; Slew Rate(SR): 0.4V/us; Output Current: 40mA; Supply Current: 1.5mA; Operating Temperature: 0℃~+70℃
VD1 VD2 = 1N4007: Supplier Footprint: DO-41
VT1-VT75 = HY5204: Supplier Part: C9900006698; Supplier Footprint: MOSFET-N; Supplier: LCSC

## Nets
48V: ?#4.V+(5) R1.2 R3.2 U7.1(+24V)
+1V: Q23.2(C)
+5V: ?#5.3(5V) ?#6.3(5V) ?#9.3(5V) C6.1 C6#2.1 C7.1 C7#2.1 C8.1 C8#2.1 C9.1 C9#2.1 C10.1 C10#2.1 C11.1 C12.1 C13.1 C14.1 C15.1 C22.2 C23.2 C24.2 C25.2 C26.2 C27.2 C28.2 C29.2 C30.2 R164.1 R168.1 R178.1 U33.3(5V) U33#2.3(5V) U59.10(SCLR#) U59.16(VCC) U59#2.10(SCLR#) U59#2.16(VCC) U60.10(SCLR#) U60.16(VCC) U60#2.10(SCLR#) U60#2.16(VCC) U61.10(SCLR#) U61.16(VCC) U61#2.10(SCLR#) U61#2.16(VCC) U62.10(SCLR#) U62.16(VCC) U62#2.10(SCLR#) U62#2.16(VCC) U63.10(SCLR#) U63.16(VCC) U63#2.10(SCLR#) U63#2.16(VCC) U65.10(SCLR#) U65.16(VCC) U66.10(SCLR#) U66.16(VCC) U67.10(SCLR#) U67.16(VCC) U68.10(SCLR#) U68.16(VCC) U69.10(SCLR#) U69.16(VCC) U70.4(VCC+) U71.4(VCC+) U73.4(VCC+)
+10V: Q22.2(C)
GND: ?#4.GND2(7) ?#5.5(GND) ?#6.5(GND) ?#7.GND2(7) ?#7.V-(4) ?#8.GND2(7) ?#8.V-(4) ?#9.5(GND) C6.2 C6#2.2 C7.2 C7#2.2 C8.2 C8#2.2 C9.2 C9#2.2 C10.2 C10#2.2 C11.2 C12.2 C13.2 C14.2 C15.2 CN1.1 CN1#2.1 CN2.1 CN3.1 Q24.2(E) Q25.2(E) R1#2.2 R2.1 R2#2.2 R3#2.2 R4.1 R4#2.2 R5#2.2 R6.1 R6#2.2 R7#2.2 R8.1 R8#2.2 R10.1 R12.1 R14.1 R16.1 R18.1 R20.1 R22.1 R22#2.1 R30.1 R30#2.1 R32.1 R32#2.1 R34.1 R34#2.1 R50.2 R51.2 R52.2 R53.2 R54.2 R55.2 R56.2 R57.2 R58.2 R59.2 R60.2 R61.2 R62.2 R63.2 R64.2 R65.2 R66.2 R67.2 R68.2 R69.2 R70.2 R71.2 R72.2 R73.2 R74.2 R75.2 R76.2 R77.2 R78.2 R79.2 R80.2 R81.2 R82.2 R83.2 R84.2 R85.2 R86.2 R87.2 R88.2 R89.2 R90.2 R91.2 R92.2 R93.2 R94.2 R95.2 R96.2 R97.2 R98.2 R99.2 R100.2 R101.2 R102.2 R103.2 R104.2 R105.2 R106.2 R107.2 R108.2 R109.2 R110.2 R111.2 R112.2 R113.2 R159.1 R173.1 U4.14(GND) U4#2.14(GND) U6.14(GND) U8.GND(2) U9.GND(2) U10.GND(2) U11.GND(2) U17.GND(2) U18.GND(2) U19.GND(2) U20.GND(2) U21.GND(2) U22.14(GND) U27.GND2(7) U27.V-(4) U27#2.GND2(7) U27#2.V-(4) U33.5(GND) U33#2.5(GND) U34.21(Питание "-" общий) U34#2.21(Питание "-" общий) U45.9(GND) U46.9(GND) U47.9(GND) U48.9(GND) U49.9(GND) U50.9(GND) U51.9(GND) U52.9(GND) U53.9(GND) U54.9(GND) U54#2.9(GND) U55.9(GND) U56.9(GND) U57.9(GND) U58.9(GND) U59.8(GND) U59.13(G#) U59#2.8(GND) U59#2.13(G#) U60.8(GND) U60.13(G#) U60#2.8(GND) U60#2.13(G#) U61.8(GND) U61.13(G#) U61#2.8(GND) U61#2.13(G#) U62.8(GND) U62.13(G#) U62#2.8(GND) U62#2.13(G#) U63.8(GND) U63.13(G#) U63#2.8(GND) U63#2.13(G#) U64.9(GND) U65.8(GND) U65.13(G#) U66.8(GND) U66.13(G#) U67.8(GND) U67.13(G#) U68.8(GND) U68.13(G#) U69.8(GND) U69.13(G#) VT1.3(S) VT2.3(S) VT3.3(S) VT4.3(S) VT5.3(S) VT6.3(S) VT7.3(S) VT8.3(S) VT9.3(S) VT10.3(S) VT11.3(S) VT12.3(S) VT13.3(S) VT14.3(S) VT15.3(S) VT16.3(S) VT17.3(S) VT18.3(S) VT19.3(S) VT20.3(S) VT21.3(S) VT22.3(S) VT23.3(S) VT24.3(S) VT25.3(S) VT26.3(S) VT27.3(S) VT28.3(S) VT29.3(S) VT30.3(S) VT31.3(S) VT32.3(S) VT33.3(S) VT34.3(S) VT35.3(S) VT36.3(S) VT37.3(S) VT38.3(S) VT39.3(S) VT40.3(S) VT41.3(S) VT42.3(S) VT43.3(S) VT44.3(S) VT45.3(S) VT46.3(S) VT47.3(S) VT48.3(S) VT49.3(S) VT50.3(S) VT51.3(S) VT52.3(S) VT53.3(S) VT54.3(S) VT55.3(S) VT56.3(S) VT57.3(S) VT58.3(S) VT59.3(S) VT60.3(S) VT61.3(S) VT62.3(S) VT63.3(S) VT64.3(S) VT65.3(S) VT66.3(S) VT67.3(S) VT68.3(S) VT69.3(S) VT70.3(S)
V1: R133.2 R134.2 R135.2 R136.2 R137.2 R138.2 R139.2 R140.2 R141.2 R142.2 R143.2 R144.2 R145.2 R146.2 R147.2 R148.2 U35#2.15(Д. температуры ОЖ в двигателе)
V2: R1#3.2 R2#3.2 R3#3.2 R4#3.2 R5#3.2 R6#3.2 R7#3.2 R8#3.2 R9#2.2 R10#2.2 R11#2.2 R12#2.2 R13#2.2 R14#2.2 R15#2.2 R16#2.2 R17#2.2 R18#2.2
V3: R114.2 R115.2 R116.2 R117.2 R118.2 R119.2 R120.2 R121.2
V4: R122.2 R123.2 R124.2 R125.2 R126.2 R127.2 R128.2 R129.2
V5: R130.2 R131.2 R132.2
V6: R152.2 U35#2.14(Д. наличия водителя на сиденье)
VIN: CN1.2 CN1#2.2 CN2.2 CN3.2 U4.15(VIN) U4#2.15(VIN) U6.15(VIN) U22.15(VIN)
+1,8V: Q23#2.2(C)
+10,8V: Q22#2.2(C)
+12: C23.1 C24.1 U71.11(VCC-)
CAN-H: U2.7
CAN-L: U2.2
D1: U4#2.18(UA0TX/D1)
D2: Q2#2.1(B) U4#2.27(LED0/D2)
D3: C30.1 Q14.1(B) R180.2 U4#2.19(UA0RX/D3) U6.19(UA0RX/D3) U22.19(UA0RX/D3)
D4: Q3#2.1(B) U4#2.26(ADC/D4)
D5: ?#1.3(CS) U4.23(D5) U4#2.23(D5) U59.14(SER) U59#2.14(SER) U65.14(SER)
D12: ?#2.4(MISO) R11.1 R12.2 R29.1 R29#2.1 R30.2 R30#2.2 U4.12(ADC/D12) U4#2.12(ADC/D12) U6.12(ADC/D12) U8.Out(3) U18.Out(3) U22.12(ADC/D12)
D13: ?#2.5(MOSI) R13.1 R14.2 R21.1 R21#2.1 R22.2 R22#2.2 U4.13(ADC/D13) U4#2.13(ADC/D13) U6.13(ADC/D13) U21.Out(3) U22.13(ADC/D13)
D14: ?#2.6(SCK) R9.1 R10.2 U6.11(ADC/D14) U9.Out(3) U17.Out(3) U22.11(ADC/D14)
D15: ?#2.3(CS) U4#2.28(ADC/D15)
D16: C27.1 R166.2 U4#2.25(UA2RX/D16)
D17: R167.1 U4#2.24(UA2TX/D17)
D18: ?#1.6(SCK) U4.22(D18) U4#2.22(D18) U6.22(D18) U59.12(RCK) U59#2.12(RCK) U60.12(RCK) U60#2.12(RCK) U61.12(RCK) U61#2.12(RCK) U62.12(RCK) U62#2.12(RCK) U63.12(RCK) U63#2.12(RCK) U65.12(RCK) U66.12(RCK) U67.12(RCK) U68.12(RCK) U69.12(RCK)
D19: ?#1.4(MISO) ?#6.4(VO) ?#9.4(VO) U4.21(D19) U4#2.21(D19) U6.21(D19) U22.21(D19) U59.11(SCK) U59#2.11(SCK) U60.11(SCK) U60#2.11(SCK) U61.11(SCK) U61#2.11(SCK) U62.11(SCK) U62#2.11(SCK) U63.11(SCK) U63#2.11(SCK) U65.11(SCK) U66.11(SCK) U67.11(SCK) U68.11(SCK) U69.11(SCK)
D21: C16.2 Q15.1(B) R149.1 U4#2.20(D21) U6.20(D21) U22.20(D21)
D22: C17.2 Q9.1(B) R150.1 U4#2.17(D22) U6.17(D22) U22.17(D22)
D23: ?#1.5(MOSI) C18.2 Q6.1(B) Q7.1(B) Q8.1(B) Q13.1(B) R151.1 U4#2.16(D23) U6.16(D23) U22.16(D23)
D25: ?#5.4(VO) U4.8(ADC/DAC0/D25) U4#2.8(ADC/DAC0/D25) U6.8(ADC/DAC0/D25) U27.PV(6) U27#2.PV(6)
D26: ?#3.2(RX) Q22.1(B) Q22#2.1(B) R5.1 R6.2 U4.9(ADC/DAC1/D26) U4#2.9(ADC/DAC1/D26) U6.9(ADC/DAC1/D26) U11.Out(3) U20.Out(3) U22.9(ADC/DAC1/D26)
D27: ?#3.1(TX) Q23.1(B) Q23#2.1(B) R7.1 R8.2 U4.10(ADC/D27) U4#2.10(ADC/D27) U6.10(ADC/D27) U10.Out(3) U19.Out(3) U22.10(ADC/D27)
D32: R1.1 R2.2 R15.1 R16.2 R31.1 R31#2.1 R32.2 R32#2.2 U4.6(ADC/D32) U4#2.6(ADC/D32) U6.6(ADC/D32) U22.6(ADC/D32)
D33: ?#4.PV(6) ?#7.PV(6) ?#8.PV(6) U4.7(ADC/D33) U4#2.7(ADC/D33) U6.7(ADC/D33) U22.7(ADC/D33) U33.4(VO) U33#2.4(VO)
F1: U35.1(Д. ПВОМ) U35#2.1(Д. ПВОМ) U54.18(OUT1) U54#2.18(OUT1)
F2: U35.2(Д. ЗВОМ) U35#2.2(Д. ЗВОМ) U54.17(OUT2) U54#2.17(OUT2)
F3: U35.3(Д. скор. левого колеса) U35#2.3(Д. скор. левого колеса) U54.16(OUT3) U54#2.16(OUT3)
F4: U35.4(Д. объема/уровня топлива в баке) U35#2.4(Д. объема/уровня топлива в баке) U54.15(OUT4) U54#2.15(OUT4)
F5: U35.5(Д. скор. правого колеса) U35#2.5(Д. скор. правого колеса) U54.14(OUT5) U54#2.14(OUT5)
F6: U35.8(Фазная обмотка "W" генератора) U35#2.8(Фазная обмотка "W" генератора) U54.13(OUT6) U54#2.13(OUT6)
I1: C16.1 R149.2 U35#2.7(Д. давления масла в двигателе) VT72.2(D)
I2: C17.1 R150.2 U35#2.9(Д. давления масла в трансмиссии) VT73.2(D)
I3: C18.1 R151.2 U35#2.11(Д. давления воздуха в пневмосистеме) VT74.2(D)
P1: U34#2.1(Д низкого давления воздуха) VT1.2(D)
P2: U34#2.3(Д. вкл. стояночного тормоза) VT2.2(D)
P3: U34#2.8(Заряд второй АКБ) VT3.2(D)
P4: U34#2.10(Д. низкого уровня торм. жидк.) VT4.2(D)
P5: U34#2.12(К блоку упр. средствами облегч. пуска) VT5.2(D)
P6: U34#2.14(Датчик засоренности возд. фильтра) VT6.2(D)
P7: U34#2.15(Кнопка "3" пульта упр.) VT7.2(D)
P8: U34#2.16(Д. низкого давления масла в ГОРУ) VT8.2(D)
P9: U34#2.17(Кнопка "2" пульта упр.) VT9.2(D)
P10: U34#2.19(Кнопка "1" пульта упр.) VT10.2(D)
P11: U35#2.6(Д. высокой температуры ОЖ) VT11.2(D)
P12: U35#2.10(Д. резервного уровня топлива в баке) VT12.2(D)
P13: U35#2.16(Повороты трактора) VT13.2(D)
P14: U35#2.17(Работа на реверсе) VT14.2(D)
P15: U35#2.18(Повороты прицепа) VT15.2(D)
P16: U36#2.8(Д. низкого давления масла в двигателе) VT16.2(D)
S1: U54.1(IN1) U54#2.1(IN1) U59.15(QA) U59#2.15(QA) VT1.1(G)
S2: U54.2(IN2) U54#2.2(IN2) U59.1(QB) U59#2.1(QB) VT2.1(G)
S3: U54.3(IN3) U54#2.3(IN3) U59.2(QC) U59#2.2(QC) VT3.1(G)
S4: U54.4(IN4) U54#2.4(IN4) U59.3(QD) U59#2.3(QD) VT4.1(G)
S5: U54.5(IN5) U54#2.5(IN5) U59.4(QE) U59#2.4(QE) VT5.1(G)
S6: U59.5(QF) U59#2.5(QF) VT6.1(G)
S7: U59.6(QG) U59#2.6(QG) VT7.1(G)
S8: U54.6(IN6) U54#2.6(IN6) U59.7(QH) U59#2.7(QH) VT8.1(G)
S9: U45.1(IN1) U55.1(IN1) U56.1(IN1) U57.1(IN1) U58.1(IN1) U60.15(QA) U60#2.15(QA) U64.1(IN1) VT9.1(G)
S10: U45.2(IN2) U55.2(IN2) U56.2(IN2) U57.2(IN2) U58.2(IN2) U60.1(QB) U60#2.1(QB) U64.2(IN2) VT10.1(G)
S11: U45.3(IN3) U55.3(IN3) U56.3(IN3) U57.3(IN3) U58.3(IN3) U60.2(QC) U60#2.2(QC) U64.3(IN3) VT11.1(G)
S12: U45.4(IN4) U55.4(IN4) U56.4(IN4) U57.4(IN4) U58.4(IN4) U60.3(QD) U60#2.3(QD) U64.4(IN4) VT12.1(G)
S13: U45.5(IN5) U55.5(IN5) U56.5(IN5) U57.5(IN5) U58.5(IN5) U60.4(QE) U60#2.4(QE) U64.5(IN5) VT13.1(G)
S14: U45.6(IN6) U55.6(IN6) U56.6(IN6) U57.6(IN6) U58.6(IN6) U60.5(QF) U60#2.5(QF) U64.6(IN6) VT14.1(G)
S15: U42.2(Кнопка "1" пульта управления) U45.7(IN7) U55.7(IN7) U56.7(IN7) U57.7(IN7) U58.7(IN7) U60.6(QG) U60#2.6(QG) U64.7(IN7) VT15.1(G)
S16: U42.4(Кнопка "2" пульта управления) U45.8(IN8) U55.8(IN8) U56.8(IN8) U57.8(IN8) U58.8(IN8) U60.7(QH) U60#2.7(QH) U64.8(IN8) VT16.1(G)
S17: U42.6(Кнопка "3" пульта управления) U61.15(QA) U61#2.15(QA) VT54.1(G)
S18: Q1.1(B) U61.1(QB) U61#2.1(QB) VT55.1(G)
S19: Q2.1(B) U61.2(QC) U61#2.2(QC) VT56.1(G)
S20: Q3.1(B) U61.3(QD) U61#2.3(QD) VT57.1(G)
S21: U61.4(QE) U61#2.4(QE) VT58.1(G)
S22: U61.5(QF) U61#2.5(QF) VT59.1(G)
S23: U61.6(QG) U61#2.6(QG) VT60.1(G)
S24: U35#2.12(Резерв) U48.1(IN1) U51.1(IN1) U61.7(QH) U61#2.7(QH) VT61.1(G)
S25: U48.2(IN2) U51.2(IN2) U62.15(QA) U62#2.15(QA) VT62.1(G)
S26: U48.3(IN3) U51.3(IN3) U62.1(QB) U62#2.1(QB) VT63.1(G)
S27: U48.4(IN4) U51.4(IN4) U62.2(QC) U62#2.2(QC) VT64.1(G)
S28: U48.5(IN5) U51.5(IN5) U62.3(QD) U62#2.3(QD) VT65.1(G)
S29: U48.6(IN6) U51.6(IN6) U62.4(QE) U62#2.4(QE) VT66.1(G)
S30: U48.7(IN7) U51.7(IN7) U62.5(QF) U62#2.5(QF) VT67.1(G)
S31: U48.8(IN8) U51.8(IN8) U62.6(QG) U62#2.6(QG) VT68.1(G)
S32: U46.1(IN1) U47.1(IN1) U49.1(IN1) U50.1(IN1) U52.1(IN1) U53.1(IN1) U62.7(QH) U62#2.7(QH) VT69.1(G)
S33: U46.2(IN2) U47.2(IN2) U49.2(IN2) U50.2(IN2) U52.2(IN2) U53.2(IN2) U63.15(QA) U63#2.15(QA) VT17.1(G)
S34: U46.3(IN3) U47.3(IN3) U49.3(IN3) U50.3(IN3) U52.3(IN3) U53.3(IN3) U63.1(QB) U63#2.1(QB) VT18.1(G)
S35: U46.4(IN4) U47.4(IN4) U49.4(IN4) U50.4(IN4) U52.4(IN4) U53.4(IN4) U63.2(QC) U63#2.2(QC) VT19.1(G)
S36: U46.5(IN5) U47.5(IN5) U49.5(IN5) U50.5(IN5) U52.5(IN5) U53.5(IN5) U63.3(QD) U63#2.3(QD) VT20.1(G)
S37: U46.6(IN6) U47.6(IN6) U49.6(IN6) U50.6(IN6) U52.6(IN6) U53.6(IN6) U63.4(QE) U63#2.4(QE) VT21.1(G)
S38: U46.7(IN7) U47.7(IN7) U49.7(IN7) U50.7(IN7) U52.7(IN7) U53.7(IN7) U63.5(QF) U63#2.5(QF) VT22.1(G)
S39: U46.8(IN8) U47.8(IN8) U49.8(IN8) U50.8(IN8) U52.8(IN8) U53.8(IN8) U63.6(QG) U63#2.6(QG) VT23.1(G)
S40: U63.7(QH) U63#2.7(QH) VT24.1(G)
S41: U65.15(QA) VT25.1(G)
S42: U65.1(QB) VT26.1(G)
S43: U65.2(QC) VT27.1(G)
S44: U65.3(QD) VT28.1(G)
S45: U65.4(QE) VT29.1(G)
S46: U65.5(QF) VT30.1(G)
S47: U65.6(QG) VT31.1(G)
S48: U65.7(QH) VT32.1(G)
S49: U66.15(QA) VT33.1(G)
S50: U66.1(QB) VT34.1(G)
S51: U66.2(QC) VT35.1(G)
S52: U66.3(QD) VT36.1(G)
S53: U66.4(QE) VT37.1(G)
S54: U66.5(QF) VT38.1(G)
S55: U66.6(QG) VT39.1(G)
S56: U66.7(QH) VT40.1(G)
S57: U67.15(QA) VT41.1(G)
S58: U67.1(QB) VT42.1(G)
S59: U67.2(QC) VT43.1(G)
S60: U67.3(QD) VT44.1(G)
S61: U67.4(QE) VT45.1(G)
S62: U67.5(QF) VT46.1(G)
S63: U67.6(QG) VT47.1(G)
S64: U67.7(QH) VT48.1(G)
S65: U68.15(QA) VT49.1(G)
S66: U68.1(QB) VT50.1(G)
S67: U68.2(QC) VT51.1(G)
S68: U68.3(QD) VT52.1(G)
S69: U68.4(QE) VT53.1(G)
S70: U68.5(QF) VT70.1(G)
S71: U68.6(QG)
S71..S76: R160.2
S72: U68.7(QH)
S73: U69.15(QA)
S74: U69.1(QB)
S75: U69.2(QC)
S76: U69.3(QD)
S77: R174.2 U69.4(QE) VT72.1(G)
S78: U69.5(QF) VT73.1(G)
S79: U69.6(QG) VT74.1(G)
S80: U69.7(QH)
U1: U34.1(Д низкого давления воздуха) U34#2.4(Выключатель подсветки) U55.18(OUT1)
U1..U7: R157.1 R158.2 VT71.3(S)
U2: U34.2(Резерв) U34#2.2(Резерв) U34#2.5(Дальний свет) U55.17(OUT2)
U3: U34.3(Д. вкл. стояночного тормоза) U34#2.6(Клемма "D" генератора) U55.16(OUT3)
U4: U34.4(Выключатель подсветки) U34#2.7(Ближний свет) U55.15(OUT4)
U5: U34.5(Дальний свет) U34#2.9(Указатель повоторов (прав.)) U55.14(OUT5)
U6: U34.6(Клемма "D" генератора) U34#2.11(Указатель поворотов (лев.)) U55.13(OUT6)
U7: U34.7(Ближний свет) U36#2.10(Резерв) U55.12(OUT7)
U8: R171.1 R172.2 R175.2 R176.1 U34.8(Заряд второй АКБ) U34#2.18(Питание "+12В" после выкл. АКБ) U55.11(OUT8) VT75.3(S)
U9: U34.9(Указатель повоторов (прав.)) U56.18(OUT1)
U10: U34.10(Д. низкого уровня торм. жидк.) U56.17(OUT2)
U11: U34.11(Указатель поворотов (лев.)) U56.16(OUT3)
U12: U34.12(К блоку упр. средствами облегч. пуска) U56.15(OUT4)
U13: U34.13(Резерв) U56.14(OUT5)
U14: U34.14(Датчик засоренности возд. фильтра) U56.13(OUT6)
U15: U34.15(Кнопка "3" пульта упр.) U56.12(OUT7)
U16: U34.16(Д. низкого давления масла в ГОРУ) U56.11(OUT8)
U17: U34.17(Кнопка "2" пульта упр.) U57.18(OUT1)
U18: U34.19(Кнопка "1" пульта упр.) U57.17(OUT2)
U19: U35.6(Д. высокой температуры ОЖ) U57.16(OUT3)
U20: U35.7(Д. давления масла в двигателе) U57.15(OUT4)
U21: U35.9(Д. давления масла в трансмиссии) U57.14(OUT5)
U22: U35.10(Д. резервного уровня топлива в баке) U57.13(OUT6)
U23: U35.11(Д. давления воздуха в пневмосистеме) U57.12(OUT7)
U24: U35.12(Резерв) U57.11(OUT8)
U25: U35.13(Резерв) U58.18(OUT1) U64.18(OUT1)
U26: U35.14(Д. наличия водителя на сиденье) U58.17(OUT2) U64.17(OUT2)
U27: U35.15(Д. температуры ОЖ в двигателе) U58.16(OUT3) U64.16(OUT3)
U28: U35.16(Повороты трактора) U58.15(OUT4) U64.15(OUT4)
U29: U35.17(Работа на реверсе) U58.14(OUT5) U64.14(OUT5)
U30: U35.18(Повороты прицепа) U58.13(OUT6) U64.13(OUT6)
U31: U36.8(Д. низкого давления масла в двигателе) U58.12(OUT7) U64.12(OUT7)
U32: U36.10(Резерв) U58.11(OUT8) U64.11(OUT8)
V+: R157.2 R171.2 VD1.1(K) VD2.1(K) VT71.2(D) VT75.2(D)
Net-(?#4-V-): ?#4.V-(4) ?#5.2(IP-) U7.2(-24V)
Net-(?#5-1): ?#5.1(IP+) R3.1 R4.2
Net-(?#6-1): ?#6.1(IP+) Q6.3(E)
Net-(?#6-2): ?#6.2(IP-) U12.1(+24В)
Net-(?#7-V+): ?#7.V+(5) Q6.2(C) Q7.2(C)
Net-(?#8-V+): ?#8.V+(5) ?#9.1(IP+)
Net-(?#9-2): ?#9.2(IP-) Q9.2(C) Q14.2(C) R15.2 R17.2 R19.2
Net-(C22-1): C22.1 R167.2 U71.3(IN1+)
Net-(C25-1): C25.1 C26.1 U70.11(VCC-)
Net-(C28-1): C28.1 C29.1 U73.11(VCC-)
Net-(Q1-2): Q1.2(C) Q3.2(C) R31.2 R33.2 U33.2(IP-)
Net-(Q1-3): Q1.3(E) U34.18(Питание "+12В" после выкл. АКБ)
Net-(Q2#2-2): Q2#2.2(C) Q3#2.2(C) R33#2.1 R34#2.2
Net-(Q2#2-3): Q2#2.3(E) U34#2.20(Питание "+12В" от АКБ)
Net-(Q2-2): Q2.2(C) R33.1 R34.2 U42.1(Питание (общий))
Net-(Q2-3): Q2.3(E) U34.20(Питание "+12В" от АКБ)
Net-(Q3#2-3): Q3#2.3(E) U34#2.22(Питание "+12В" после выкл. стартера)
Net-(Q3-3): Q3.3(E) U34.22(Питание "+12В" после выкл. стартера)
Net-(Q7-3): Q7.3(E) U12.3(+24В)
Net-(Q9-3): Q9.3(E) U28.1(+24В)
Net-(Q13-2): Q13.2(C) R17.1 R18.2
Net-(Q13-3): Q13.3(E) U28.2(Подсветка)
Net-(Q14-3): Q14.3(E) U28.3(+24В)
Net-(Q15-2): Q15.2(C) R19.1 R20.2
Net-(Q15-3): Q15.3(E) U29.3(Спидометр)
Net-(Q22#2-3): Q22#2.3(E) Q23#2.3(E) U54#2.10(COM)
Net-(Q22-3): Q22.3(E) Q23.3(E) U54.10(COM)
Net-(Q24-1): Q24.1(B) R159.2 R160.1
Net-(Q24-3): Q24.3(C) R158.1
Net-(Q25-1): Q25.1(B) R173.2 R174.1
Net-(Q25-3): Q25.3(C) R172.1
Net-(R1#2-1): R1#2.1 U45.18(OUT1)
Net-(R1#3-1): R1#3.1 VT17.2(D)
Net-(R2#2-1): R2#2.1 U45.17(OUT2)
Net-(R2#3-1): R2#3.1 VT18.2(D)
Net-(R3#2-1): R3#2.1 U45.16(OUT3)
Net-(R3#3-1): R3#3.1 VT19.2(D)
Net-(R4#2-1): R4#2.1 U45.15(OUT4)
Net-(R4#3-1): R4#3.1 VT20.2(D)
Net-(R5#2-1): R5#2.1 U45.14(OUT5)
Net-(R5#3-1): R5#3.1 VT21.2(D)
Net-(R5-2): R5.2 U29.7(Сигнал скорости)
Net-(R6#2-1): R6#2.1 U45.13(OUT6)
Net-(R6#3-1): R6#3.1 VT22.2(D)
Net-(R7#2-1): R7#2.1 U45.12(OUT7)
Net-(R7#3-1): R7#3.1 VT23.2(D)
Net-(R7-2): R7.2 U29.8(Сигнал импульсов)
Net-(R8#2-1): R8#2.1 U45.11(OUT8)
Net-(R8#3-1): R8#3.1 VT24.2(D)
Net-(R9#2-1): R9#2.1 VT25.2(D)
Net-(R9-2): R9.2 U31.5(Упр-е нагрузкой)
Net-(R10#2-1): R10#2.1 VT26.2(D)
Net-(R11#2-1): R11#2.1 VT27.2(D)
Net-(R11-2): R11.2 U32.8(Малая скорость)
Net-(R12#2-1): R12#2.1 VT28.2(D)
Net-(R13#2-1): R13#2.1 VT29.2(D)
Net-(R13-2): R13.2 U29.1(+8В)
Net-(R14#2-1): R14#2.1 VT30.2(D)
Net-(R15#2-1): R15#2.1 VT31.2(D)
Net-(R16#2-1): R16#2.1 VT32.2(D)
Net-(R17#2-1): R17#2.1 VT33.2(D)
Net-(R18#2-1): R18#2.1 VT34.2(D)
Net-(R21#2-2): R21#2.2 U36#2.4(Выход питания датчиков)
Net-(R21-2): R21.2 U36.4(Выход питания датчиков)
Net-(R29#2-2): R29#2.2 U36#2.2(Выход питания датчиков)
Net-(R29-2): R29.2 U36.2(Выход питания датчиков)
Net-(R31#2-2): R31#2.2 R33#2.2 U33#2.2(IP-)
Net-(R50-1): R50.1 U46.18(OUT1)
Net-(R51-1): R51.1 U46.17(OUT2)
Net-(R52-1): R52.1 U46.16(OUT3)
Net-(R53-1): R53.1 U46.15(OUT4)
Net-(R54-1): R54.1 U46.14(OUT5)
Net-(R55-1): R55.1 U46.13(OUT6)
Net-(R56-1): R56.1 U46.12(OUT7)
Net-(R57-1): R57.1 U46.11(OUT8)
Net-(R58-1): R58.1 U47.18(OUT1)
Net-(R59-1): R59.1 U47.17(OUT2)
Net-(R60-1): R60.1 U47.16(OUT3)
Net-(R61-1): R61.1 U47.15(OUT4)
Net-(R62-1): R62.1 U47.14(OUT5)
Net-(R63-1): R63.1 U47.13(OUT6)
Net-(R64-1): R64.1 U47.12(OUT7)
Net-(R65-1): R65.1 U47.11(OUT8)
Net-(R66-1): R66.1 U48.18(OUT1)
Net-(R67-1): R67.1 U48.17(OUT2)
Net-(R68-1): R68.1 U48.16(OUT3)
Net-(R69-1): R69.1 U48.15(OUT4)
Net-(R70-1): R70.1 U48.14(OUT5)
Net-(R71-1): R71.1 U48.13(OUT6)
Net-(R72-1): R72.1 U48.12(OUT7)
Net-(R73-1): R73.1 U48.11(OUT8)
Net-(R74-1): R74.1 U49.18(OUT1)
Net-(R75-1): R75.1 U49.17(OUT2)
Net-(R76-1): R76.1 U49.16(OUT3)
Net-(R77-1): R77.1 U49.15(OUT4)
Net-(R78-1): R78.1 U49.14(OUT5)
Net-(R79-1): R79.1 U49.13(OUT6)
Net-(R80-1): R80.1 U49.12(OUT7)
Net-(R81-1): R81.1 U49.11(OUT8)
Net-(R82-1): R82.1 U50.18(OUT1)
Net-(R83-1): R83.1 U50.17(OUT2)
Net-(R84-1): R84.1 U50.16(OUT3)
Net-(R85-1): R85.1 U50.15(OUT4)
Net-(R86-1): R86.1 U50.14(OUT5)
Net-(R87-1): R87.1 U50.13(OUT6)
Net-(R88-1): R88.1 U50.12(OUT7)
Net-(R89-1): R89.1 U50.11(OUT8)
Net-(R90-1): R90.1 U51.18(OUT1)
Net-(R91-1): R91.1 U51.17(OUT2)
Net-(R92-1): R92.1 U51.16(OUT3)
Net-(R93-1): R93.1 U51.15(OUT4)
Net-(R94-1): R94.1 U51.14(OUT5)
Net-(R95-1): R95.1 U51.13(OUT6)
Net-(R96-1): R96.1 U51.12(OUT7)
Net-(R97-1): R97.1 U51.11(OUT8)
Net-(R98-1): R98.1 U52.18(OUT1)
Net-(R99-1): R99.1 U52.17(OUT2)
Net-(R100-1): R100.1 U52.16(OUT3)
Net-(R101-1): R101.1 U52.15(OUT4)
Net-(R102-1): R102.1 U52.14(OUT5)
Net-(R103-1): R103.1 U52.13(OUT6)
Net-(R104-1): R104.1 U52.12(OUT7)
Net-(R105-1): R105.1 U52.11(OUT8)
Net-(R106-1): R106.1 U53.18(OUT1)
Net-(R107-1): R107.1 U53.17(OUT2)
Net-(R108-1): R108.1 U53.16(OUT3)
Net-(R109-1): R109.1 U53.15(OUT4)
Net-(R110-1): R110.1 U53.14(OUT5)
Net-(R111-1): R111.1 U53.13(OUT6)
Net-(R112-1): R112.1 U53.12(OUT7)
Net-(R113-1): R113.1 U53.11(OUT8)
Net-(R114-1): R114.1 VT35.2(D)
Net-(R115-1): R115.1 VT36.2(D)
Net-(R116-1): R116.1 VT37.2(D)
Net-(R117-1): R117.1 VT38.2(D)
Net-(R118-1): R118.1 VT39.2(D)
Net-(R119-1): R119.1 VT40.2(D)
Net-(R120-1): R120.1 VT41.2(D)
Net-(R121-1): R121.1 VT42.2(D)
Net-(R122-1): R122.1 VT43.2(D)
Net-(R123-1): R123.1 VT44.2(D)
Net-(R124-1): R124.1 VT45.2(D)
Net-(R125-1): R125.1 VT46.2(D)
Net-(R126-1): R126.1 VT47.2(D)
Net-(R127-1): R127.1 VT48.2(D)
Net-(R128-1): R128.1 VT49.2(D)
Net-(R129-1): R129.1 VT50.2(D)
Net-(R130-1): R130.1 VT51.2(D)
Net-(R131-1): R131.1 VT52.2(D)
Net-(R132-1): R132.1 VT53.2(D)
Net-(R133-1): R133.1 VT54.2(D)
Net-(R134-1): R134.1 VT55.2(D)
Net-(R135-1): R135.1 VT56.2(D)
Net-(R136-1): R136.1 VT57.2(D)
Net-(R137-1): R137.1 VT58.2(D)
Net-(R138-1): R138.1 VT59.2(D)
Net-(R139-1): R139.1 VT60.2(D)
Net-(R140-1): R140.1 VT61.2(D)
Net-(R141-1): R141.1 VT62.2(D)
Net-(R142-1): R142.1 VT63.2(D)
Net-(R143-1): R143.1 VT64.2(D)
Net-(R144-1): R144.1 VT65.2(D)
Net-(R145-1): R145.1 VT66.2(D)
Net-(R146-1): R146.1 VT67.2(D)
Net-(R147-1): R147.1 VT68.2(D)
Net-(R148-1): R148.1 VT69.2(D)
Net-(R152-1): R152.1 VT70.2(D)
Net-(R161-1): R161.1 R163.1 VT72.3(S) VT73.3(S) VT74.3(S)
Net-(R161-2): R161.2 R162.1 R170.2
Net-(R162-2): R162.2 R164.2 U70.3(IN1+)
Net-(R163-2): R163.2 R165.2 U70.2(IN1-)
Net-(R165-1): R165.1 R166.1 U70.1(OUT1)
Net-(R168-2): R168.2 U72.2(IN1-)
Net-(R170-1): R170.1 U72.1(OUT1)
Net-(R175-1): R175.1 R177.1
Net-(R176-2): R176.2 R178.2 U73.3(IN1+)
Net-(R177-2): R177.2 R179.2 U73.2(IN1-)
Net-(R179-1): R179.1 R180.1 U73.1(OUT1)
Net-(U7-3): U7.3(ДСС) U8.VCC(1)
Net-(U7-5): U7.5(ДМС) U10.VCC(1)
Net-(U7-6): U7.6(ДУН) U11.VCC(1)
Net-(U13-1): U13.1(+8В) U21.VCC(1)
Net-(U13-7): U13.7(Сигнал скорости) U20.VCC(1)
Net-(U13-8): U13.8(Сигнал импульсов) U19.VCC(1)
Net-(U15-5): U15.5(Упр-е нагрузкой) U17.VCC(1)
Net-(U16-8): U16.8(Малая скорость) U18.VCC(1)
Net-(U27#2-V+): U27#2.V+(5) U33#2.1(IP+)
Net-(U27-V+): U27.V+(5) U33.1(IP+)
Net-(U45-10): U45.10(COM) U46.10(COM) U47.10(COM) U48.10(COM) U49.10(COM) U50.10(COM) U51.10(COM) U52.10(COM) U53.10(COM) U55.10(COM) U56.10(COM) U57.10(COM) U58.10(COM)
Net-(U59#2-9): U59#2.9(Q′H) U60#2.14(SER)
Net-(U59-9): U59.9(Q′H) U60.14(SER)
Net-(U60#2-9): U60#2.9(Q′H) U61#2.14(SER)
Net-(U60-9): U60.9(Q′H) U61.14(SER)
Net-(U61#2-9): U61#2.9(Q′H) U62#2.14(SER)
Net-(U61-9): U61.9(Q′H) U62.14(SER)
Net-(U62#2-9): U62#2.9(Q′H) U63#2.14(SER)
Net-(U62-9): U62.9(Q′H) U63.14(SER)
Net-(U65-9): U65.9(Q′H) U66.14(SER)
Net-(U66-9): U66.9(Q′H) U67.14(SER)
Net-(U67-9): U67.9(Q′H) U68.14(SER)
Net-(U68-9): U68.9(Q′H) U69.14(SER)
Net-(U71-1): U71.1(OUT1) U71.2(IN1-) U72.3(IN1+)
Net-(VD1-2): VD1.2(A) VT71.1(G)
Net-(VD2-2): VD2.2(A) VT75.1(G)

Not connected (* = marked no-connect by the designer): ?#1 1(VCC) 2(GND) 7(INT) 8(CANL) 9(CANH); ?#2 1(VCC) 2(GND) 7(INT) 8(CANL) 9(CANH); ?#3 3(5V) 4(GND) 5(Can_H) 6(Can_L); ?#4 GND(3) L(1) N(2); ?#7 GND(3) L(1) N(2); ?#8 GND(3) L(1) N(2); Q8 2(C) 3(E); R169 1 2; U1 1 2 3 4 5 6 7 8 9 10(MH1) 11(MH2); U2 1 3 4 5 6 8 9 10(MH1) 11(MH2); U3 1(EN) 2(ADC/D36*) 3(ADC/D39*) 4(ADC/D34*) 5(ADC/D35*) 6(ADC/D32) 7(ADC/D33) 8(ADC/DAC0/D25) 9(ADC/DAC1/D26) 10(ADC/D27) 11(ADC/D14) 12(ADC/D12) 13(ADC/D13) 14(GND) 15(VIN) 16(D23) 17(D22) 18(UA0TX/D1) 19(UA0RX/D3) 20(D21) 21(D19) 22(D18) 23(D5) 24(UA2TX/D17) 25(UA2RX/D16) 26(ADC/D4) 27(LED0/D2) 28(ADC/D15) 29(GND) 30(3V3); U4 1(EN) 2(ADC/D36*) 3(ADC/D39*) 4(ADC/D34*) 5(ADC/D35*) 11(ADC/D14) 16(D23) 17(D22) 18(UA0TX/D1) 19(UA0RX/D3) 20(D21) 24(UA2TX/D17) 25(UA2RX/D16) 26(ADC/D4) 27(LED0/D2) 28(ADC/D15) 29(GND) 30(3V3); U4#2 1(EN) 2(ADC/D36*) 3(ADC/D39*) 4(ADC/D34*) 5(ADC/D35*) 11(ADC/D14) 29(GND) 30(3V3); U6 1(EN) 2(ADC/D36*) 3(ADC/D39*) 4(ADC/D34*) 5(ADC/D35*) 18(UA0TX/D1) 23(D5) 24(UA2TX/D17) 25(UA2RX/D16) 26(ADC/D4) 27(LED0/D2) 28(ADC/D15) 29(GND) 30(3V3); U7 4(ДПР); U9 VCC(1); U12 2(Подсветка) 4(CANH) 5(Резерв) 6("-" АКБ) 7(CAN_GND) 8(CANL); U13 2(GND) 3(Спидометр) 4(Резерв) 5(Резерв) 6(Резерв); U14 1(CANH) 2(CANL) 3(CAN_GND) 4(CAN_T) 5(Резерв) 6(Резерв) 7(Резерв) 8(Резерв); U22 1(EN) 2(ADC/D36*) 3(ADC/D39*) 4(ADC/D34*) 5(ADC/D35*) 8(ADC/DAC0/D25) 18(UA0TX/D1) 22(D18) 23(D5) 24(UA2TX/D17) 25(UA2RX/D16) 26(ADC/D4) 27(LED0/D2) 28(ADC/D15) 29(GND) 30(3V3); U27 GND(3) L(1) N(2); U27#2 GND(3) L(1) N(2); U28 4(CANH) 5(Резерв) 6("-" АКБ) 7(CAN_GND) 8(CANL); U29 2(GND) 4(Резерв) 5(Резерв) 6(Резерв); U30 1(CANH) 2(CANL) 3(CAN_GND) 4(CAN_T) 5(Резерв) 6(Резерв) 7(Резерв) 8(Резерв); U34#2 13(Резерв); U35#2 13(Резерв); U36 1(CAN_L3) 3(CAN_H3) 5(CAN_GND3) 6(CAN_GND2) 7(CAN_L2) 9(CAN_H2); U36#2 1(CAN_L3) 3(CAN_H3) 5(CAN_GND3) 6(CAN_GND2) 7(CAN_L2) 9(CAN_H2); U42 3(-) 5(-); U54 7(IN7) 8(IN8) 11(OUT8) 12(OUT7); U54#2 7(IN7) 8(IN8) 11(OUT8) 12(OUT7); U63 9(Q′H)*; U63#2 9(Q′H)*; U64 10(COM); U69 9(Q′H)*; U72 4(VCC+) 11(VCC-)

## Notes on the sheets
sheet 1
- Расстояние между рядами - 25,4 мм
- При использовании
  модуля HW-021 и
  встроенного интерфейса
- При использовании
  модуля MCP2515 и
  интерфейса ESP32V
- При использовании
  модуля MCP2515 и
  интерфейса ESP32H
- Схема подключения к DB9F
  SAE J1939
  250kBPs,16MHz
sheet 2
- Блок питания
  SPV-150-48
- Управление АКБ
  и измерение силы тока
- 1..5.5В
- ДУН - датчик управления нагрузкой
  ДМС - датчик малой скорости
  ДПР - датчик пройденного расстояния
  ДСС - датчик сигнала скорости
- Управление зажиганием
- Управление зажиганием
- Блок питания
  для ESP32
- Измерение напряжения
  блока питания
  делитель 48В-3.3В
- Блок питания
  SPV-150-48
- 1..5.5В
- 0..48В
- Делитель
  напряжения 48В/24В
- Измерение тока щитка
  (до 25В, 5А)
sheet 3
- Блок питания
  SPV-150-48
- Измерение силы тока
- 1..5.5В
- Управление АКБ
- Измерение напряжения
  блока питания
  делитель 48В-3.3В
- Делитель 24В-10В
- Делитель 24В-10В
- Управление подсветкой
- Управление зажиганием
- Блок питания
  для ESP32
- Сигнал скорости
- Делители напряжения
  10В/3.3В
sheet 4
- Блок питания
  SPV-150-24
- Измерение силы тока
- 1..5.5В
- Питание "+12В" после выкл. АКБ
- Измерение напряжения
  блока питания
  делитель 24В-3.3В
- Блок питания
  для ESP32
- Делитель 24В-12В
- Питание "+12В" от АКБ
- Питание "+12В" после выкл. стартера
- Сдвиговые регистры (11 шт.)
  (для 80 сигналов)
- 2..6V
  70mA
- Делители напряжения
  12В/3.3В
- Магазин сопротивлений (72 резистора)
  (в том числе 0Ом)
- 50V
  0,5A
- 50V
  0,5A
- 50V
  0,5A
- 50V
  0,5A
- Задатчик частотных сигналов
- 50V
  0,5A
- 50V
  0,5A
- 50V
  0,5A
- 50V
  0,5A
- 50V
  0,5A
- 50V
  0,5A
- 50V
  0,5A
- 50V
  0,5A
- 50V
  0,5A
- 50V
  0,5A
- 50V
  0,5A
sheet 5
- Блок питания
  SPV-150-24
- Измерение силы тока
- 1..5.5В
- Измерение напряжения
  блока питания
  делитель 24В-3.3В
- Блок питания
  для ESP32
- Делитель 24В-12В
- Питание "+12В" от АКБ
- Питание "+12В" после выкл. стартера
- Сдвиговые регистры (10 шт.)
  (для 80 сигналов)
- 2..6V
  70mA
- Делители напряжения
  12В/3.3В
- 2..6V
  70mA
- Задатчик частотных сигналов
- 50V
  0,5A
sheet 6
- Сигналы "плюс" (7)
- Сигнал "плюс" после АКБ
- Сигналы "земля" (16)
- Измерение тока
- Датчик температуры ОЖ в двигателе (16)
- 0..3,3В
- Измерение тока
- Датчик наличия водителя (1)
- 4..20мА
- Датчик объема уровня топлива (18)
- Датчик давления воздуха в пневмосистеме (8)
- Датчик давления масла в двигателе (8)
- Датчик давления масла
  в трансмиссии (3)
- Датчик наличия водителя
  на сидении (1)
